# EAGLE design MainBoard (EAGLE 7.7.0)

## Sheet 1 of 2
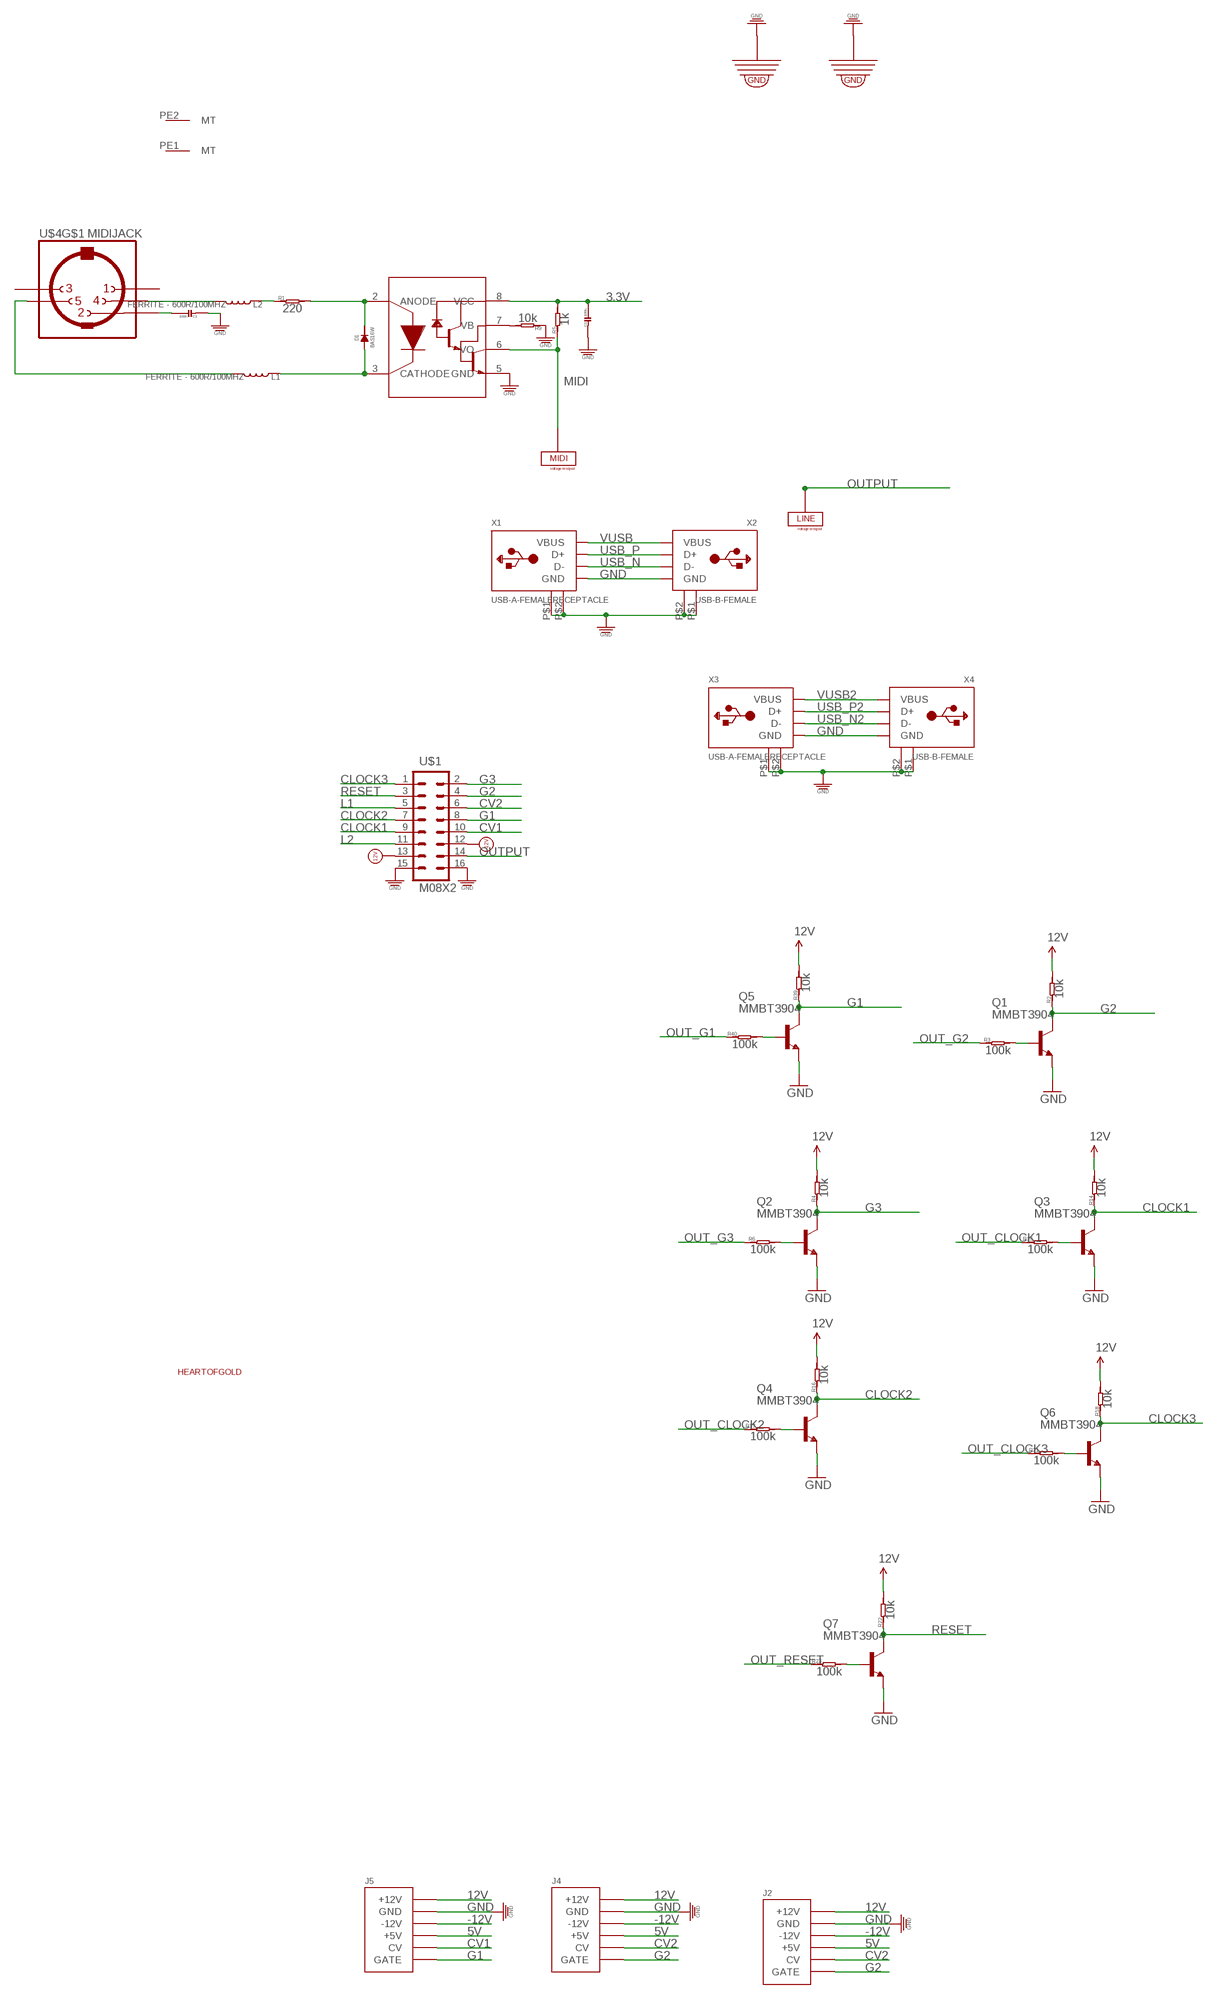
[diagram p0: schematic, sheet 1, part 1 of 3]
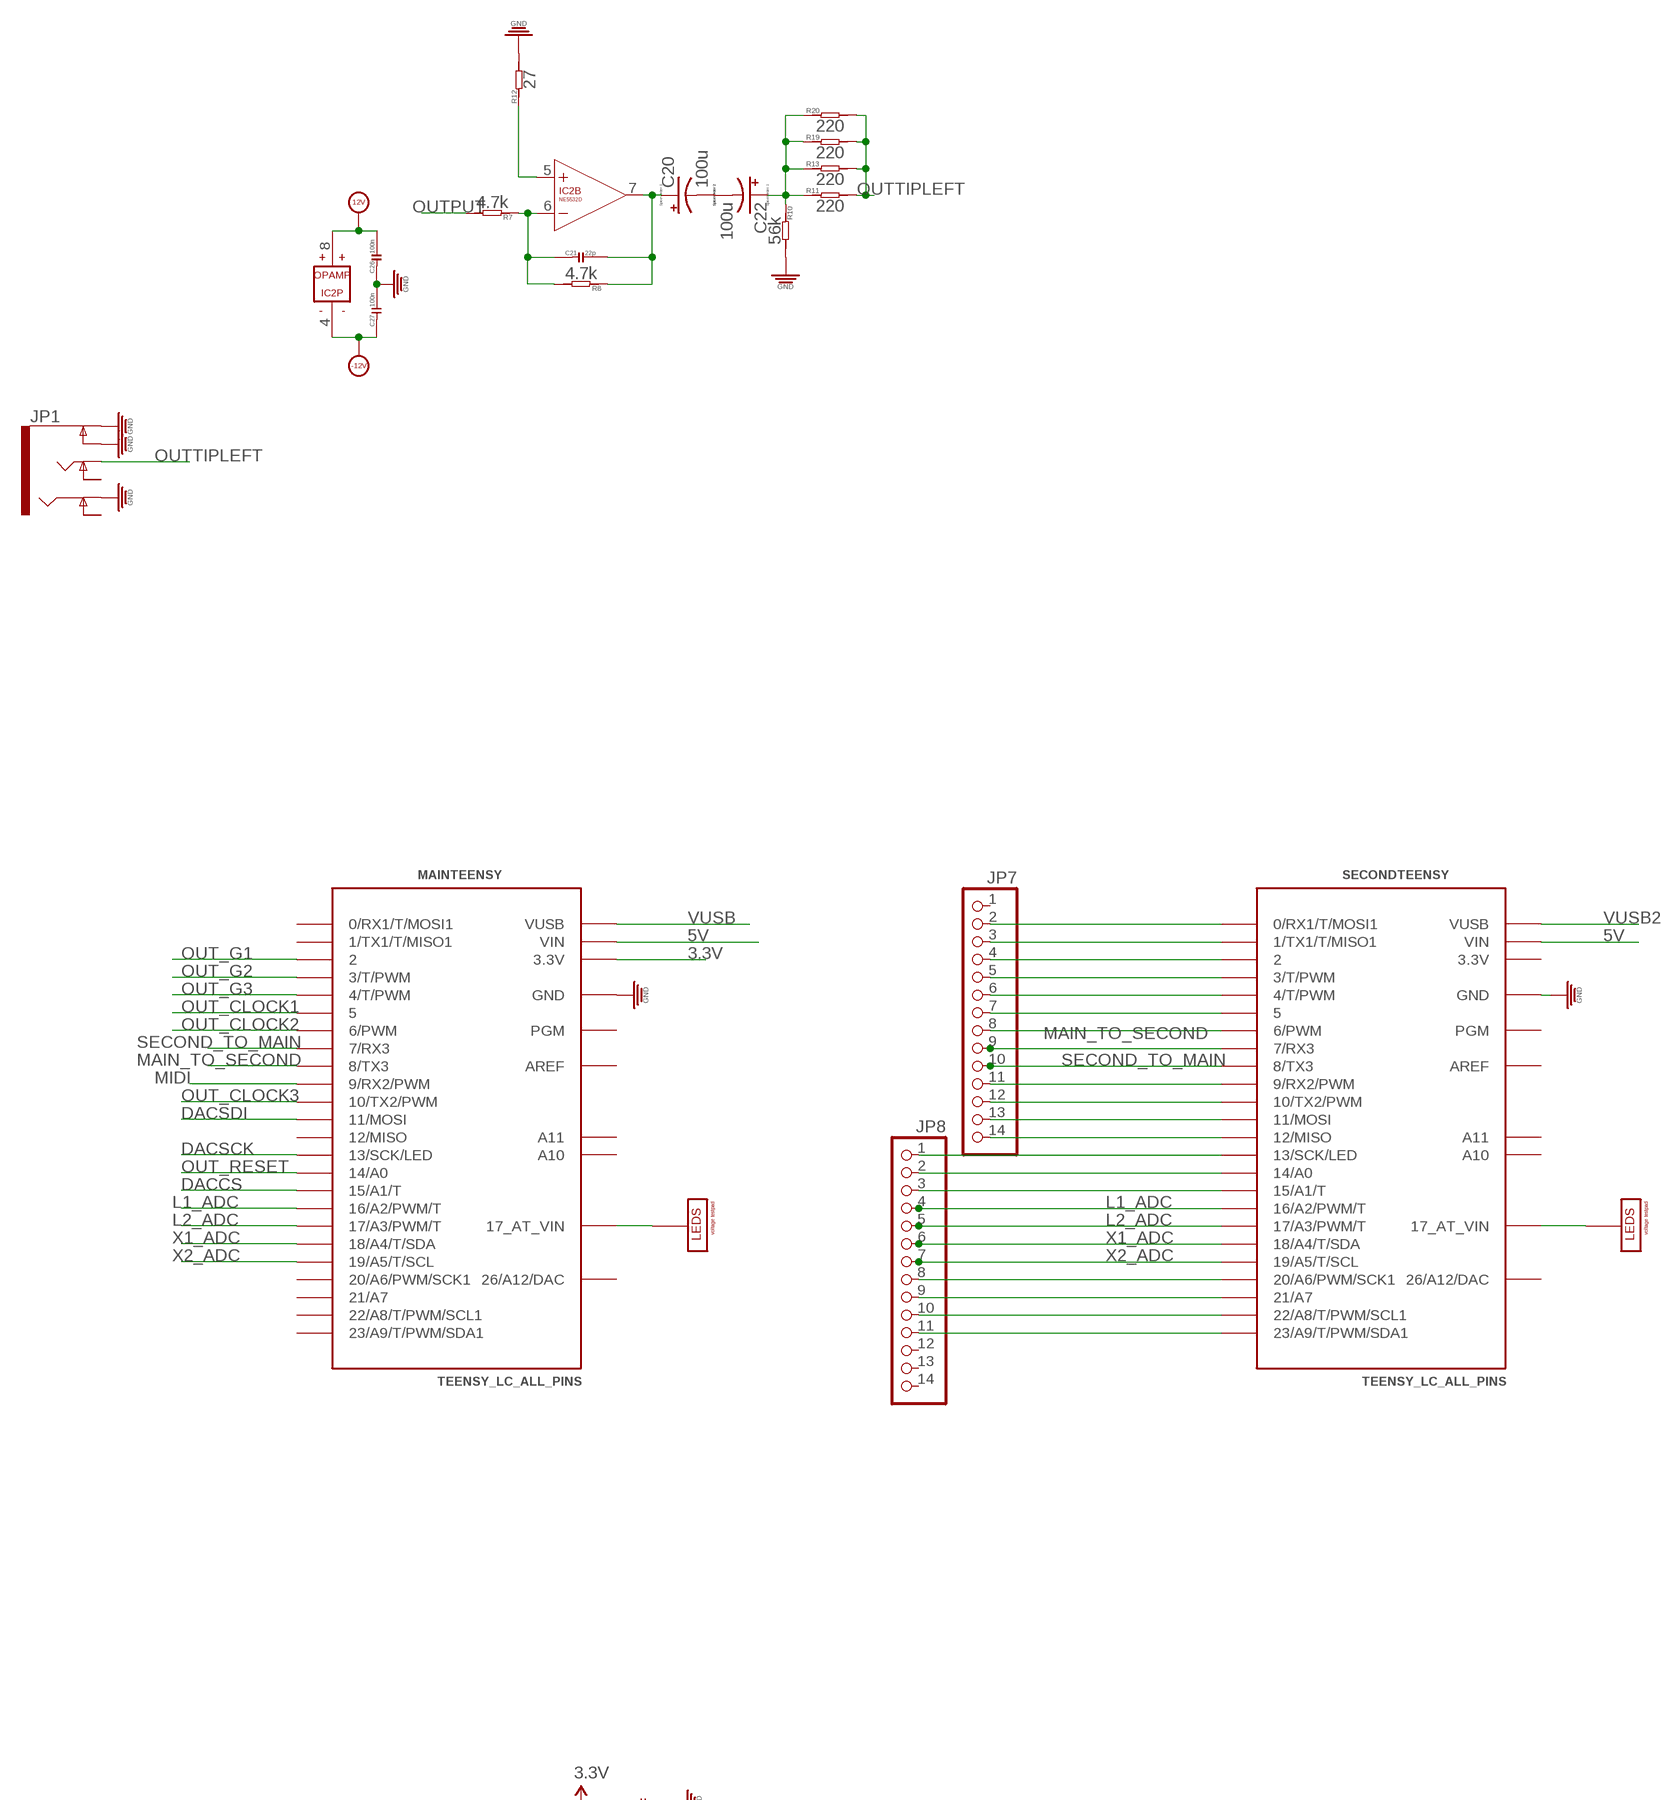
[diagram p1: schematic, sheet 1, part 2 of 3]
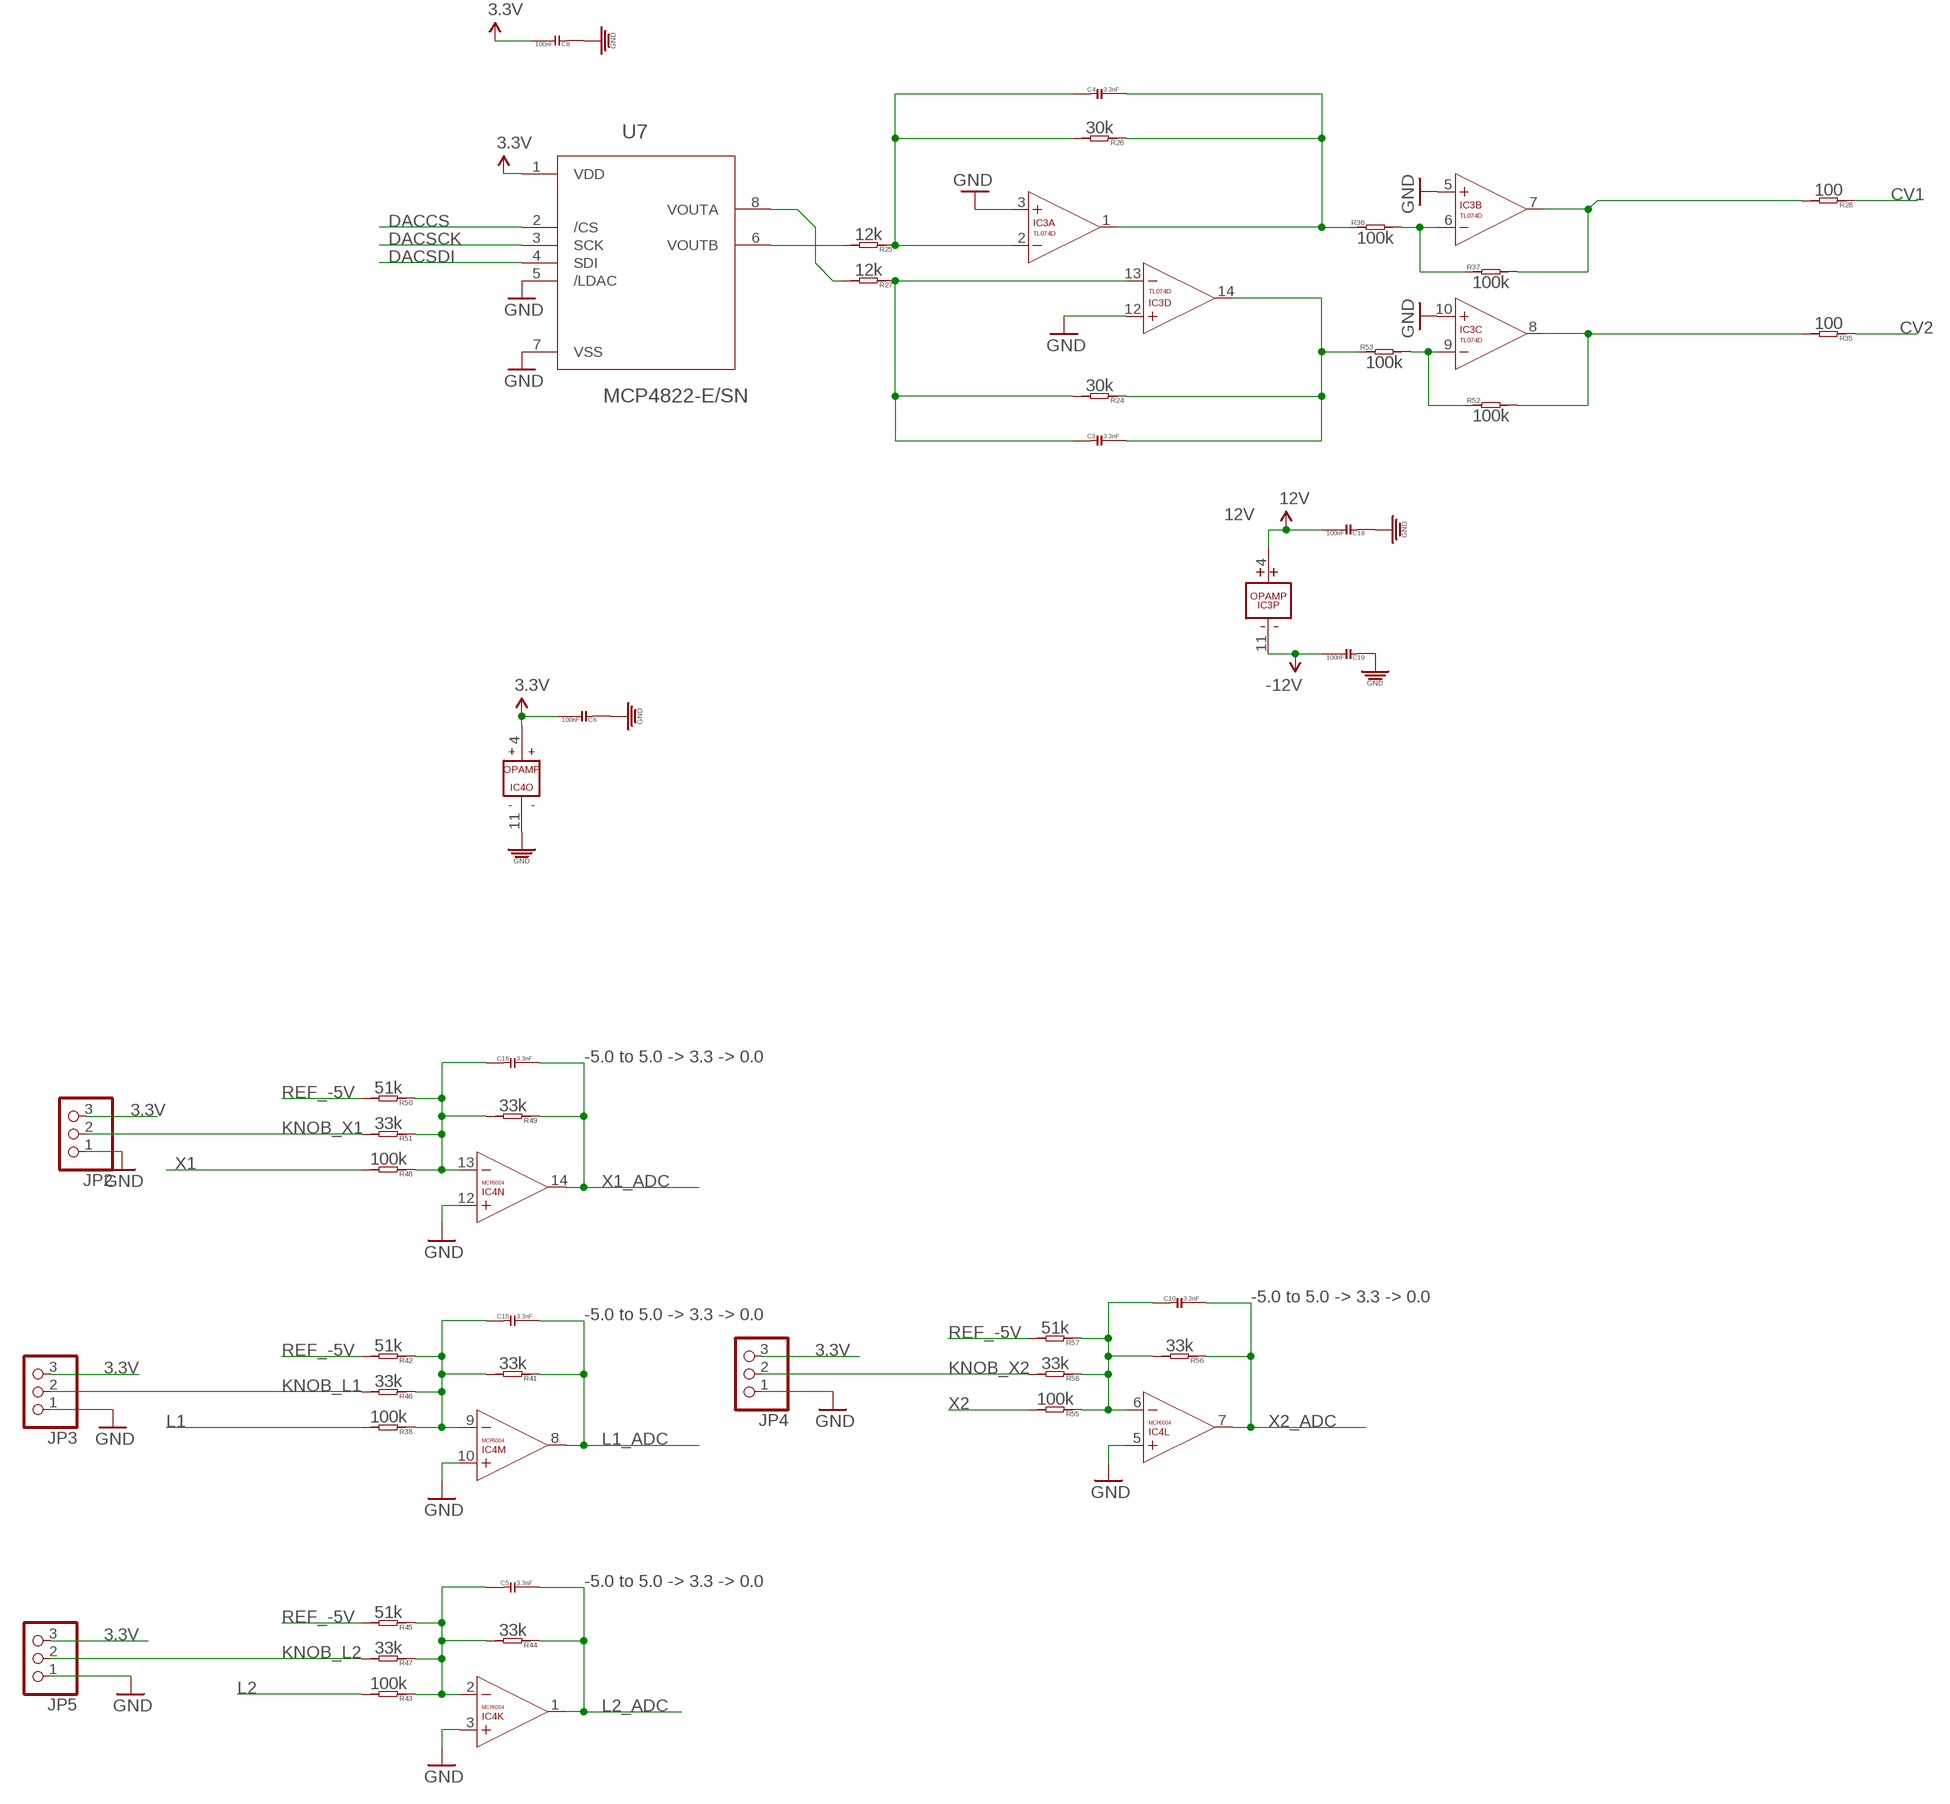
[diagram p2: schematic, sheet 1, part 3 of 3]

### Parts
C1  100n  C-0603  [C0603]
C2  100n  C-0603  [C0603]
C3  3.3nF  C-0603  [C0603]
C4  3.3nF  C-0603  [C0603]
C5  3.3nF  C-0603  [C0603]
C6  100nF  C-0603  [C0603]
C8  100nF  C-0603  [C0603]
C10  3.3nF  C-0603  [C0603]
C15  3.3nF  C-0603  [C0603]
C16  3.3nF  C-0603  [C0603]
C18  100nF  C-0603  [C0603]
C19  100nF  C-0603  [C0603]
C20  100u  CPOL-USD  [PANASONIC_D]
C21  22p  C-0603  [C0603]
C22  100u  CPOL-USD  [PANASONIC_D]
C26  100n  C-0603  [C0603]
C27  100n  C-0603  [C0603]
D1  BAS16W  [SOT-323]
IC2  NE5532D  [SO08]
IC3  TL074D  [SO14]
IC4  MCP6004  [SO14]
J2  POWER_SHROUDED_NOTEXT  [POWER_16_SHROUDED_NOTEXT]
J4  POWERSHROUDED  [POWER_16_SHROUDED]
J5  POWERSHROUDED  [POWER_16_SHROUDED]
JP1  AUDIO-JACK4-.25-HORIZ-TRS  [AUDIO-JACK-.25-INCH-HORIZ-PTH]
JP2  PINHD-1X3  [1X03]
JP3  PINHD-1X3  [1X03]
JP4  PINHD-1X3  [1X03]
JP5  PINHD-1X3  [1X03]
JP7  PINHD-1X14  [1X14]
JP8  PINHD-1X14  [1X14]
L1  FERRITE - 600R/100MHZ  L-0603  [L0603]
L2  FERRITE - 600R/100MHZ  L-0603  [L0603]
MAINTEENSY  TEENSY_LC_ALL_PINS  [TEENSY_3.0-3.2&LC_ALL_PINS]
Q1  MMBT3904  MMBT3904LT1-NPN-SOT23-BEC  [SOT23-BEC]
Q2  MMBT3904  MMBT3904LT1-NPN-SOT23-BEC  [SOT23-BEC]
Q3  MMBT3904  MMBT3904LT1-NPN-SOT23-BEC  [SOT23-BEC]
Q4  MMBT3904  MMBT3904LT1-NPN-SOT23-BEC  [SOT23-BEC]
Q5  MMBT3904  MMBT3904LT1-NPN-SOT23-BEC  [SOT23-BEC]
Q6  MMBT3904  MMBT3904LT1-NPN-SOT23-BEC  [SOT23-BEC]
Q7  MMBT3904  MMBT3904LT1-NPN-SOT23-BEC  [SOT23-BEC]
R1  220  R-0603  [R0603]
R2  10k  R-0603  [R0603]
R3  100k  R-0603  [R0603]
R4  10k  R-0603  [R0603]
R5  1k  R-0603  [R0603]
R6  100k  R-0603  [R0603]
R7  4.7k  R-0603  [R0603]
R8  4.7k  R-0603  [R0603]
R9  10k  R-0603  [R0603]
R10  56k  R-0603  [R0603]
R11  220  R-0603  [R0603]
R12  27  R-0603  [R0603]
R13  220  R-0603  [R0603]
R14  10k  R-0603  [R0603]
R15  100k  R-0603  [R0603]
R16  10k  R-0603  [R0603]
R17  100k  R-0603  [R0603]
R18  10k  R-0603  [R0603]
R19  220  R-0603  [R0603]
R20  220  R-0603  [R0603]
R21  100k  R-0603  [R0603]
R22  10k  R-0603  [R0603]
R23  100k  R-0603  [R0603]
R24  30k  R-0603  [R0603]
R25  12k  R-0603  [R0603]
R26  30k  R-0603  [R0603]
R27  12k  R-0603  [R0603]
R28  100  R-0603  [R0603]
R35  100  R-0603  [R0603]
R36  100k  R-0603  [R0603]
R37  100k  R-0603  [R0603]
R38  100k  R-0603  [R0603]
R39  10k  R-0603  [R0603]
R40  100k  R-0603  [R0603]
R41  33k  R-0603  [R0603]
R42  51k  R-0603  [R0603]
R43  100k  R-0603  [R0603]
R44  33k  R-0603  [R0603]
R45  51k  R-0603  [R0603]
R46  33k  R-0603  [R0603]
R47  33k  R-0603  [R0603]
R48  100k  R-0603  [R0603]
R49  33k  R-0603  [R0603]
R50  51k  R-0603  [R0603]
R51  33k  R-0603  [R0603]
R52  100k  R-0603  [R0603]
R53  100k  R-0603  [R0603]
R55  100k  R-0603  [R0603]
R56  33k  R-0603  [R0603]
R57  51k  R-0603  [R0603]
R58  33k  R-0603  [R0603]
SECONDTEENSY  TEENSY_LC_ALL_PINS  [TEENSY_3.0-3.2&LC_ALL_PINS]
U7  MCP4822-E/SN  [SOIC8-N_MC]
U$1  M08X2  [2X8]
U$3  VOLTAGETESTPAD  [POWERTESTPAD]
U$4  MIDIJACK  [CP-2350]
U$5  VOLTAGETESTPAD  [POWERTESTPAD]
U$17  HEARTOFGOLD  [HEARTOFGOLD]
U$19  GNDLOOP  [GROUNDLOOP]
U$20  6N139S  [8DIPSMD]
U$22  GNDLOOP  [GROUNDLOOP]
U$30  VOLTAGETESTPAD  [POWERTESTPAD]
U$32  VOLTAGETESTPAD  [POWERTESTPAD]
X1  USB-A-FEMALERECEPTACLE  [FCI87520]
X2  USB-B-FEMALE  [FCI61729]
X3  USB-A-FEMALERECEPTACLE  [FCI87520]
X4  USB-B-FEMALE  [FCI61729]

### Nets
3.3V [thin]: C2.2 C6.2 C8.2 IC4.4(O:V+) JP2.3 JP3.3 JP4.3 JP5.3 MAINTEENSY.3.3V MAINTEENSY.3.3V1(3.3V) R5.2 U7.1(VDD) U$20.8(VCC)
5V [power]: J2.11(+5V) J2.12(+5V) J4.11(+5V) J4.12(+5V) J5.11(+5V) J5.12(+5V) MAINTEENSY.VIN SECONDTEENSY.VIN ; also sheet 2
12V [power]: C18.2 C26.2 IC2.8(P:V+) IC3.4(P:V+) J2.9(+12V) J2.10(+12V) J4.9(+12V) J4.10(+12V) J5.9(+12V) J5.10(+12V) R2.2 R4.2 R14.2 R16.2 R18.2 R22.2 R39.2 U$1.13 ; also sheet 2
-12V [power]: C19.2 C27.1 IC2.4(P:V-) IC3.11(P:V-) J2.1(-12V) J2.2(-12V) J4.1(-12V) J4.2(-12V) J5.1(-12V) J5.2(-12V) U$1.12 ; also sheet 2
CLOCK1: Q3.C R14.1 U$1.9
CLOCK2: Q4.C R16.1 U$1.7
CLOCK3: Q6.C R18.1 U$1.1
CV1: J5.13(CV) J5.14(CV) R28.1 U$1.10
CV2: J2.13(CV) J2.14(CV) J4.13(CV) J4.14(CV) R35.1 U$1.6
DACCS: MAINTEENSY.15/A1(15/A1/T) U7.2(/CS)
DACSCK: MAINTEENSY.13(13/SCK/LED) U7.3(SCK)
DACSDI: MAINTEENSY.11(11/MOSI) U7.4(SDI)
G1: J5.15(GATE) J5.16(GATE) Q5.C R39.1 U$1.8
G2: J2.15(GATE) J2.16(GATE) J4.15(GATE) J4.16(GATE) Q1.C R2.1 U$1.4
G3: Q2.C R4.1 U$1.2
GND: C1.1 C2.1 C6.1 C8.1 C18.1 C19.1 C26.1 C27.2 IC3.3(A:+IN) IC3.5(B:+IN) IC3.10(C:+IN) IC3.12(D:+IN) IC4.3(K:+IN) IC4.5(L:+IN) IC4.10(M:+IN) IC4.11(O:V-) IC4.12(N:+IN) J2.3(GND) J2.4(GND) J2.5(GND) J2.6(GND) J2.7(GND) J2.8(GND) J4.3(GND) J4.4(GND) J4.5(GND) J4.6(GND) J4.7(GND) J4.8(GND) J5.3(GND) J5.4(GND) J5.5(GND) J5.6(GND) J5.7(GND) J5.8(GND) JP1.P$2(EARTH) JP1.P$3(EARTH-NORM) JP1.P$4(RING) JP2.1 JP3.1 JP4.1 JP5.1 MAINTEENSY.AGND(GND) MAINTEENSY.GND MAINTEENSY.GND1(GND) Q1.E Q2.E Q3.E Q4.E Q5.E Q6.E Q7.E R9.1 R10.2 R12.2 SECONDTEENSY.AGND(GND) SECONDTEENSY.GND SECONDTEENSY.GND1(GND) U7.5(/LDAC) U7.7(VSS) U$1.15 U$1.16 U$19.P$1 U$19.P$2 U$20.5(GND) U$22.P$1 U$22.P$2 X1.P4(GND) X1.P$1(GND1) X1.P$2(GND2) X2.4(GND) X2.P$1(GND1) X2.P$2(GND2) X3.P4(GND) X3.P$1(GND1) X3.P$2(GND2) X4.4(GND) X4.P$1(GND1) X4.P$2(GND2) ; also sheet 2
KNOB_L1: JP3.2 R46.2
KNOB_L2: JP5.2 R47.2
KNOB_X1: JP2.2 R51.2
KNOB_X2: JP4.2 R58.2
L1: R38.2 U$1.5
L1_ADC: C15.2 IC4.8(M:OUT) JP8.4 MAINTEENSY.16/A2(16/A2/PWM/T) R41.1 SECONDTEENSY.16/A2(16/A2/PWM/T)
L2: R43.2 U$1.11
L2_ADC: C5.2 IC4.1(K:OUT) JP8.5 MAINTEENSY.17/A3(17/A3/PWM/T) R44.1 SECONDTEENSY.17/A3(17/A3/PWM/T)
MAIN_TO_SECOND: JP7.9 MAINTEENSY.8(8/TX3) SECONDTEENSY.7(7/RX3)
MIDI [thin]: MAINTEENSY.9(9/RX2/PWM) R5.1 U$20.6(VO) U$30.P$1(VOLTAGE) U$30.P$2(VOLTAGE) U$30.P$3(VOLTAGE)
N$2: R9.2 U$20.7(VB)
N$3: C20.- C22.-
N$6: L1.2 U$4.5
N$7: L2.2 U$4.4
N$10: MAINTEENSY.VBAT(17_AT_VIN) U$3.P$1(VOLTAGE) U$3.P$2(VOLTAGE) U$3.P$3(VOLTAGE)
N$12: SECONDTEENSY.VBAT(17_AT_VIN) U$5.P$1(VOLTAGE) U$5.P$2(VOLTAGE) U$5.P$3(VOLTAGE)
N$13: C21.1 IC2.6(B:-IN) R7.1 R8.2
N$14: C20.+ C21.2 IC2.7(B:OUT) R8.1
N$15: C22.+ R10.1 R11.1 R13.1 R19.1 R20.1
N$16: IC2.5(B:+IN) R12.1
N$17: Q1.B R3.2
N$18: Q2.B R6.2
N$19: Q3.B R15.2
N$20: Q4.B R17.2
N$21: Q6.B R21.2
N$22: Q7.B R23.2
N$23: C4.2 IC3.1(A:OUT) R26.1 R36.1
N$24: C3.2 IC3.14(D:OUT) R24.1 R53.1
N$25: C3.1 IC3.13(D:-IN) R24.2 R27.1
N$26: C4.1 IC3.2(A:-IN) R25.1 R26.2
N$27: C10.1 IC4.6(L:-IN) R55.1 R56.2 R57.1 R58.1
N$30: JP7.2 SECONDTEENSY.0(0/RX1/T/MOSI1)
N$31: IC3.6(B:-IN) R36.2 R37.1
N$35: IC3.7(B:OUT) R28.2 R37.2
N$36: IC3.9(C:-IN) R52.1 R53.2
N$37: R27.2 U7.8(VOUTA)
N$38: R25.2 U7.6(VOUTB)
N$39: JP7.3 SECONDTEENSY.1(1/TX1/T/MISO1)
N$40: C1.2 U$4.2
N$41: L2.1 R1.1
N$42: D1.ANODE L1.1 U$20.3(CATHODE)
N$43: D1.CATHODE R1.2 U$20.2(ANODE)
N$44: C15.1 IC4.9(M:-IN) R38.1 R41.2 R42.1 R46.1
N$45: JP7.4 SECONDTEENSY.2
N$46: C5.1 IC4.2(K:-IN) R43.1 R44.2 R45.1 R47.1
N$47: JP7.5 SECONDTEENSY.3(3/T/PWM)
N$48: C16.1 IC4.13(N:-IN) R48.1 R49.2 R50.1 R51.1
N$49: JP7.6 SECONDTEENSY.4(4/T/PWM)
N$50: JP7.7 SECONDTEENSY.5
N$51: JP7.8 SECONDTEENSY.6(6/PWM)
N$52: JP7.11 SECONDTEENSY.9(9/RX2/PWM)
N$53: JP7.12 SECONDTEENSY.10(10/TX2/PWM)
N$54: JP7.13 SECONDTEENSY.11(11/MOSI)
N$55: JP7.14 SECONDTEENSY.12(12/MISO)
N$56: JP8.1 SECONDTEENSY.13(13/SCK/LED)
N$57: JP8.2 SECONDTEENSY.14/A0
N$58: JP8.3 SECONDTEENSY.15/A1(15/A1/T)
N$59: JP8.8 SECONDTEENSY.20/A6(20/A6/PWM/SCK1)
N$60: Q5.B R40.2
N$61: JP8.9 SECONDTEENSY.21/A7
N$62: JP8.10 SECONDTEENSY.22/A8(22/A8/T/PWM/SCL1)
N$63: JP8.11 SECONDTEENSY.23/A9(23/A9/T/PWM/SDA1)
N$94: IC3.8(C:OUT) R35.2 R52.2
OUT_CLOCK1: MAINTEENSY.5 R15.1
OUT_CLOCK2: MAINTEENSY.6(6/PWM) R17.1
OUT_CLOCK3: MAINTEENSY.10(10/TX2/PWM) R21.1
OUT_G1: MAINTEENSY.2 R40.1
OUT_G2: MAINTEENSY.3(3/T/PWM) R3.1
OUT_G3: MAINTEENSY.4(4/T/PWM) R6.1
OUT_RESET: MAINTEENSY.14/A0 R23.1
OUTPUT: R7.2 U$1.14 U$32.P$1(VOLTAGE) U$32.P$2(VOLTAGE) U$32.P$3(VOLTAGE)
OUTTIPLEFT: JP1.P$6(TIP) R11.2 R13.2 R19.2 R20.2
REF_-5V: R42.2 R45.2 R50.2 R57.2 ; also sheet 2
RESET: Q7.C R22.1 U$1.3
SECOND_TO_MAIN: JP7.10 MAINTEENSY.7(7/RX3) SECONDTEENSY.8(8/TX3)
USB_N [USB]: X1.P2(D-) X2.2(D-)
USB_N2 [USB]: X3.P2(D-) X4.2(D-)
USB_P [USB]: X1.P3(D+) X2.3(D+)
USB_P2 [USB]: X3.P3(D+) X4.3(D+)
VUSB: MAINTEENSY.VUSB X1.P1(VBUS) X2.1(VBUS)
VUSB2 [power]: SECONDTEENSY.VUSB X3.P1(VBUS) X4.1(VBUS)
X1: R48.2
X1_ADC: C16.2 IC4.14(N:OUT) JP8.6 MAINTEENSY.18/A4(18/A4/T/SDA) R49.1 SECONDTEENSY.18/A4(18/A4/T/SDA)
X2: R55.2
X2_ADC: C10.2 IC4.7(L:OUT) JP8.7 MAINTEENSY.19/A5(19/A5/T/SCL) R56.1 SECONDTEENSY.19/A5(19/A5/T/SCL)
Unconnected: IC2.1(A:OUT) IC2.2(A:-IN) IC2.3(A:+IN) JP1.P$5(RING-NORM) JP1.P$7(TIP-NORM) JP7.1 JP8.12 JP8.13 JP8.14 MAINTEENSY.0(0/RX1/T/MOSI1) MAINTEENSY.1(1/TX1/T/MISO1) MAINTEENSY.12(12/MISO) MAINTEENSY.20/A6(20/A6/PWM/SCK1) MAINTEENSY.21/A7 MAINTEENSY.22/A8(22/A8/T/PWM/SCL1) MAINTEENSY.23/A9(23/A9/T/PWM/SDA1) MAINTEENSY.A10 MAINTEENSY.A11 MAINTEENSY.AREF MAINTEENSY.PGM MAINTEENSY.RESET/DAC(26/A12/DAC) SECONDTEENSY.3.3V SECONDTEENSY.3.3V1(3.3V) SECONDTEENSY.A10 SECONDTEENSY.A11 SECONDTEENSY.AREF SECONDTEENSY.PGM SECONDTEENSY.RESET/DAC(26/A12/DAC) U$4.1 U$4.3 U$4.PE1(MT) U$4.PE2(MT) U$4.PE(MT) U$4.PE@(MT)

### Notes on the sheet
- -5.0 to 5.0 -> 3.3 -> 0.0
- -5.0 to 5.0 -> 3.3 -> 0.0
- -5.0 to 5.0 -> 3.3 -> 0.0
- -5.0 to 5.0 -> 3.3 -> 0.0

## Sheet 2 of 2: Voltages
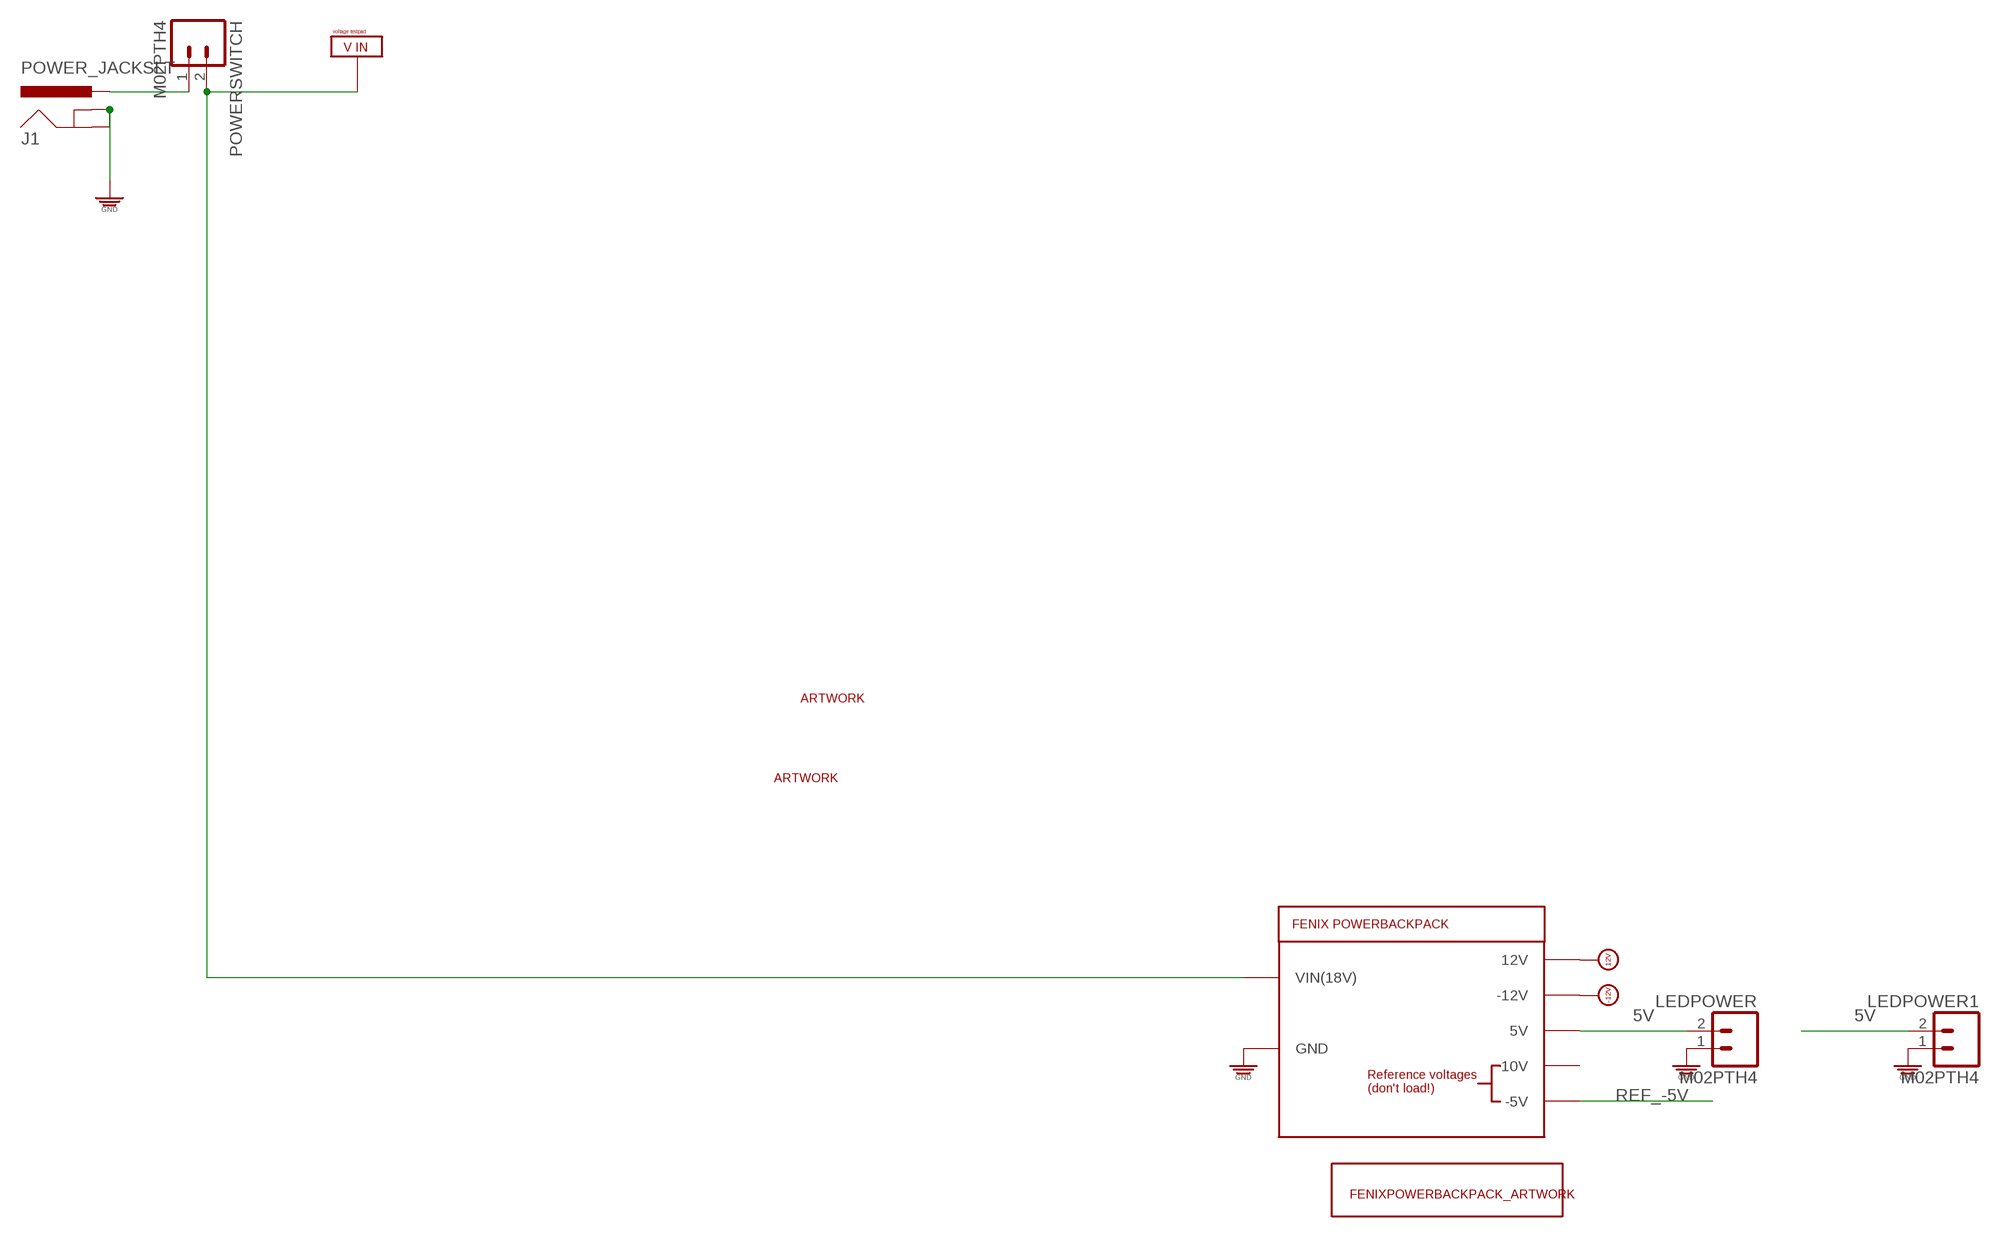
[diagram p3: schematic, sheet 2]

### Parts
J1  POWER_JACKSLT  [POWER_JACK_SLOT]
LEDPOWER  M02PTH4  [1X02_XTRA_BIG]
LEDPOWER1  M02PTH4  [1X02_XTRA_BIG]
POWERSWITCH  M02PTH4  [1X02_XTRA_BIG]
U$23  FENIXPOWERBACKPACK_MODULE  [FENIXPOWERBACKPACK]
U$25  FENIXPOWERBACKPACKART_MODULE  [FENIXPOWERBACKPACK_MODULE]
U$29  VOLTAGETESTPAD  [POWERTESTPAD]
U$34  TINRS_ARTWORKTINYDATE  [JUSTATINYROCKET_DATECODE]
U$35  TINRS_ARTWORKTINYDATE  [JUSTATINYROCKET_DATECODE]

### Nets
5V [power]: LEDPOWER1.2 LEDPOWER.2 U$23.5V@1(5V) U$23.5V@2(5V) U$23.5V@3(5V) U$23.5V@4(5V) ; also sheet 1
9TO18V [power]: POWERSWITCH.2 U$23.VIN@1(VIN(18V)) U$23.VIN@2(VIN(18V)) U$23.VIN@3(VIN(18V)) U$23.VIN@4(VIN(18V)) U$29.P$1(VOLTAGE) U$29.P$2(VOLTAGE) U$29.P$3(VOLTAGE)
12V [power]: U$23.12V@1(12V) U$23.12V@2(12V) U$23.12V@4(12V) ; also sheet 1
-12V [power]: U$23.-12V@1(-12V) U$23.-12V@2(-12V) U$23.-12V@3(-12V) ; also sheet 1
GND: J1.GND@1(GNDBREAK) J1.GND@2(GND) LEDPOWER1.1 LEDPOWER.1 U$23.GND@1(GND) U$23.GND@2(GND) U$23.GND@3(GND) U$23.GND@4(GND) U$23.GND@5(GND) U$23.GND@6(GND) U$23.GND@7(GND) U$23.GND@8(GND) U$23.GND@9(GND) U$23.GND@10(GND) U$23.GND@11(GND) U$23.GND@12(GND) U$23.GND@13(GND) U$23.GND@14(GND) ; also sheet 1
REF_-5V: U$23.-5V U$23.-5V@2(-5V) ; also sheet 1
VIN [power]: J1.PWR POWERSWITCH.1
Unconnected: U$23.10V U$23.10V@2(10V)

## Library data of the parts
C1 C2 C21 C26 C27 = OPL:C*
C3-C5 C10 C15 C16 = OPL:C*; OC_FARNELL: unknown
C6 C8 C18 C19 = OPL:C*; MF: MULTICOMP; MPN: MC0603F104Z160CT; OC_FARNELL: 1759017
C20 C22 = resistor:CPOL-US: POLARIZED CAPACITOR, American symbol
D1 = FenixBase:BAS16W
IC2 = EurorackModularParts:NE5532: AUDIO AMPLIFIER
IC3 = EurorackModularParts:TL074: OP AMP; MF: TEXAS INSTRUMENTS; MPN: TL074CD; OC_FARNELL: 1103010
IC4 = EurorackModularParts:MCP6004; MF: MICROCHIP; MPN: MCP6004-I/SL.; OC_FARNELL: 1605572
J1 = SparkFun-Connectors:POWER_JACK: Power Jack This is the standard 5.5mm barrel jack for power. The PTH is the most common, proven, reliable, footprint. The Slot footprint only works if the mill layer is transmitted to the PCB fab house so be warned. Spark Fun Electronics SKU : PRT-00119 SMT: CONN-08106 Mating wall wart : TOL-00298 (and others)
J2 J4 J5 = EurorackModularParts:POWER
JP1 = EurorackModularParts:AUDIO-JACK4-.25-HORIZ-TRS: 1/4" TRS jack, horizontal Production SKU: COM-11144 Footprint unproven - datasheet and part seem to be slightly different; PROD_ID: COM-11144
JP2-JP5 = pinhead:PINHD-1X3: PIN HEADER
JP7 JP8 = pinhead:PINHD-1X14: PIN HEADER
L1 L2 = OPL:L*
LEDPOWER LEDPOWER1 POWERSWITCH = SparkFun-Connectors:M02: Standard 2-pin 0.1" header. Use with - straight break away headers ( PRT-00116) - right angle break away headers (PRT-00553) - swiss pins (PRT-00743) - machine pins (PRT-00117) - female headers (PRT-00115) Molex polarized connector foot print use with: PRT-08233 with associated crimp pins and housings. 2.54_SCREWTERM for use with PRT-10571. 3.5mm Screw Terminal footprints for PRT-08084 5mm Screw Terminal footprints for use with PRT-08433
MAINTEENSY SECONDTEENSY = Teensy_3_and_LC_Series_Boards_v1.4:TEENSY_LC_ALL_PINS: Teensy LC board with all pins used.
Q1-Q7 = transistor:*-NPN-: NPN Transistror BF959 corrected 2008.03.06; MF: NXP; MPN: PMBT3904,215; OC_FARNELL: 2336795
R1 R5 R7-R13 R19 R20 = OPL:R*
R2-R4 R6 R14-R18 R21-R28 R35-R53 R55-R58 = OPL:R*; OC_FARNELL: unknown
U7 = FarnellThings:MCP4822-E/SN: 12 Bit DAC; DESCRIPTION: 12 Bit DAC; MF: MICROCHIP; MPN: MCP4822-E/SN; OC_FARNELL: 1439414; OC_NEWARK: 31K2975; PACKAGE: SOIC-8; SUPPLIER: Microchip
U$1 = SparkFun-Connectors:M08X2: .1" headers, two rows of 8 each
U$3 U$5 = FenixBase:VOLTAGETESTPAD; DESC: LEDS
U$4 = adafruit:MIDIJACK: DIN 5 jack also known as MIDI jack A modification of conn-hirshman:MAB5SH with two options for the grounding 'teeth'
U$17 = FenixBase:HEARTOFGOLD
U$19 U$22 = FenixBase:GNDLOOP
U$20 = FenixBase:6N139S
U$23 = EurorackModularParts:FENIXPOWERBACKPACK
U$25 = EurorackModularParts:FENIXPOWERBACKPACKART
U$29 = FenixBase:VOLTAGETESTPAD; DESC: V IN
U$30 = FenixBase:VOLTAGETESTPAD; DESC: MIDI
U$32 = FenixBase:VOLTAGETESTPAD; DESC: LINE
U$34 U$35 = EurorackModularParts:TINRS_ARTWORK
X1 X3 = ld-components:USB-A-FEMALE: USB type A receptacle FCI 87520-0010BLF
X2 X4 = ld-components:USB-B-FEMALE: USB type B receptacle FCI 61729-59796

## Net classes
0 default: width 0.254 mm
1 power: width 1 mm
2 thin: width 0.254 mm
3 USB: width 0.254 mm, clearance 0.254 mm

## Board
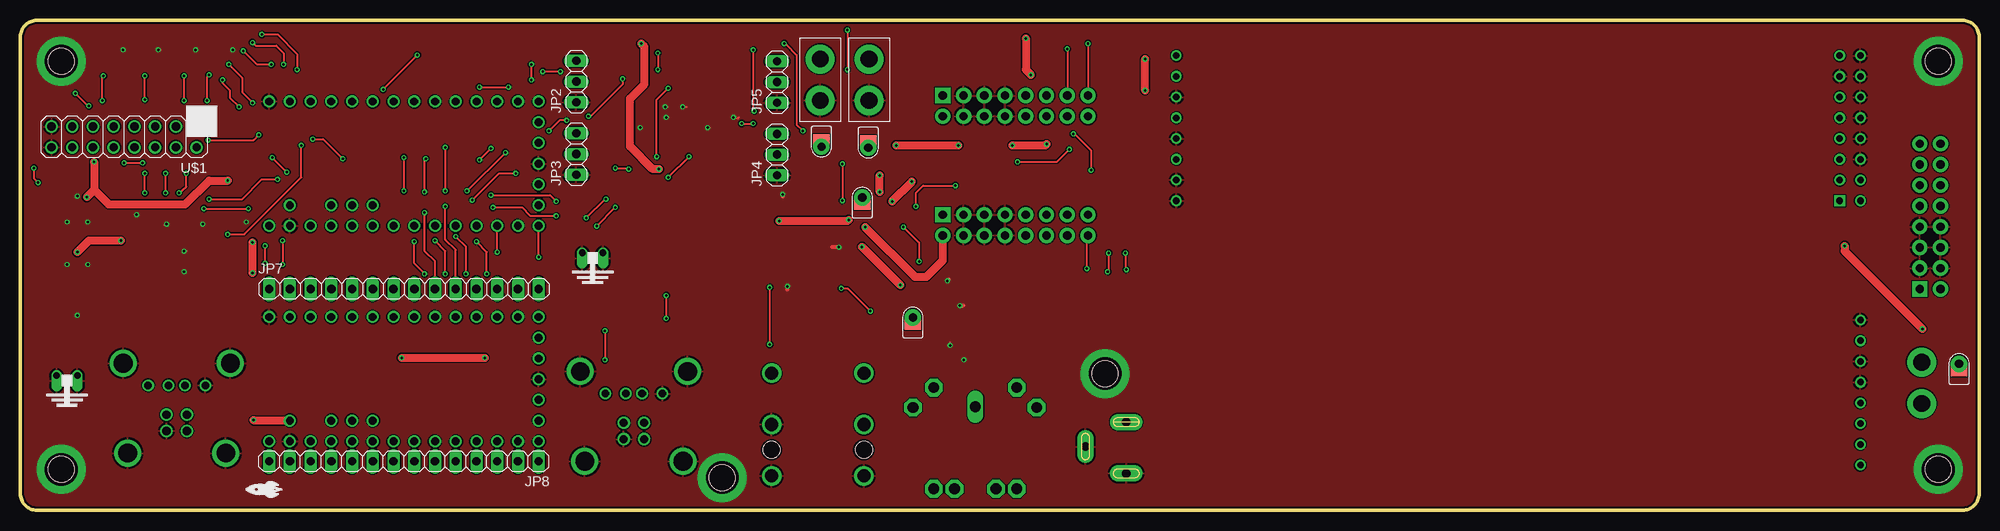
[diagram p4: board, top side]
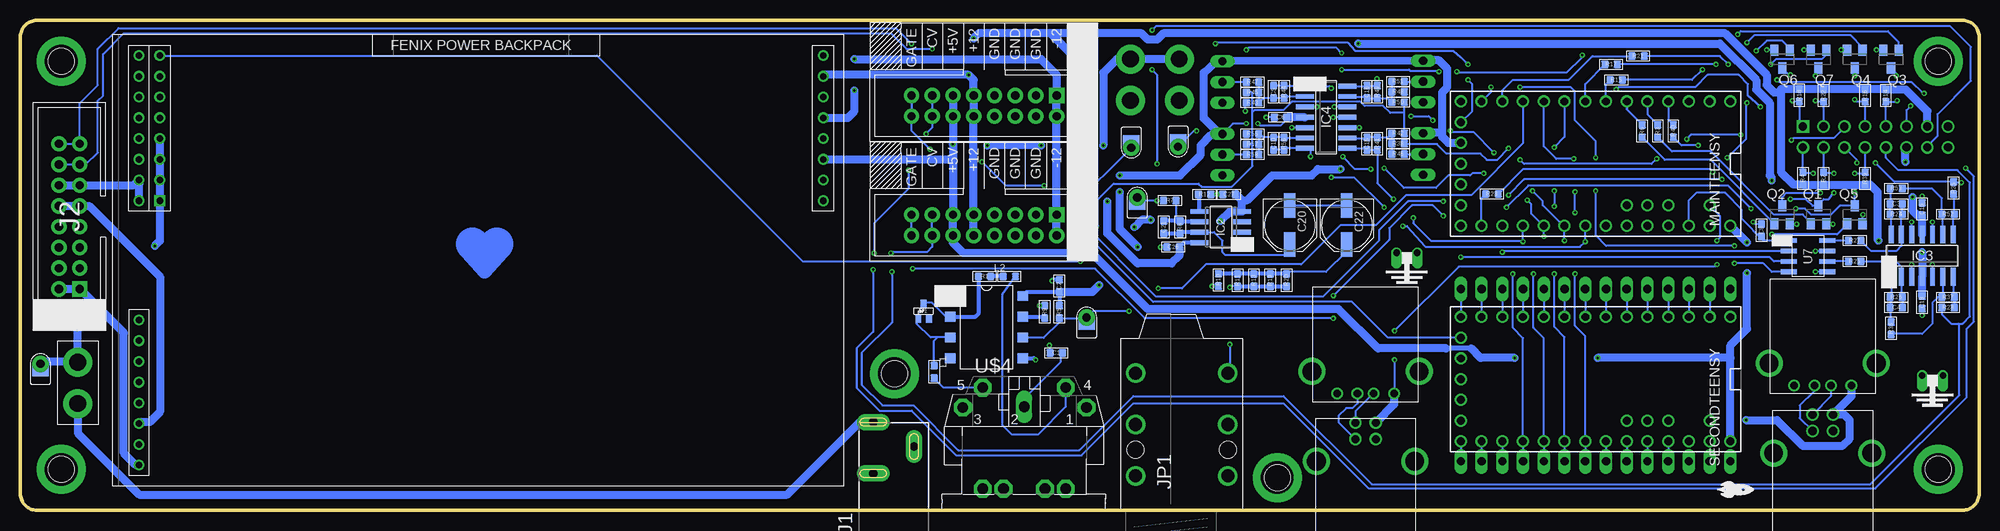
[diagram p5: board, bottom side, seen from below]

Size 240 x 60 mm. Coordinates in mm from the lower left corner, seen from the top.
Outline: 240,58 240,2 arc-90 238,0 2,0 arc-90 0,2 0,58 arc-90 2,60 238,60 arc-90 240,58
Copper layers (1*16): Top 0.035mm / dielectric 1.5mm / Bottom 0.035mm
Design rules "ITEADstudio_DRC": minimum track width 6mil, minimum drill 12mil, track to track 6mil, track to pad 6mil, pad to pad 6mil, via to via 6mil, smd to smd 0mil, copper to edge 10mil, drill to drill 10mil, minimum pad ring 10mil, minimum via ring 6mil, stop-mask expansion 2mil, vias tented up to drill 100mil, thermal gap 10mil
Holes 3.2 mm at 235,5 5,55 5,5 132.91,16.73 235,55 86,4

### Footprints (pad centres in the part's own frame; a part is rotated, then mirrored left to right if it is on the bottom)
C0603 = smd 0.889 x 0.889: 1 -0.762,0; 2 0.762,0
PANASONIC_D = smd 3 x 1.4: + 2.4,0; - -2.4,0
SOT-323 = smd 0.7 x 0.9: ANODE -0.65,-0.95; CATHODE 0,0.95; NC 0.65,-0.95
SO08 = smd 0.6 x 2.2: 1 -1.905,-2.6; 2 -0.635,-2.6; 3 0.635,-2.6; 4 1.905,-2.6; 5 1.905,2.6; 6 0.635,2.6; 7 -0.635,2.6; 8 -1.905,2.6
SO14 = smd 0.6 x 2.2: 1 -3.81,-2.6; 2 -2.54,-2.6; 3 -1.27,-2.6; 4 0,-2.6; 5 1.27,-2.6; 6 2.54,-2.6; 7 3.81,-2.6; 8 3.81,2.6; 9 2.54,2.6; 10 1.27,2.6; 11 0,2.6; 12 -1.27,2.6; 13 -2.54,2.6; 14 -3.81,2.6
POWER_JACK_SLOT = drill 1 pad 2 long: GND@1 2.58,7.5; GND@2 7.58,10.8; PWR 2.58,13.8
POWER_16_SHROUDED_NOTEXT = drill 1.016 pad 1.88 square: 1 -8.89,-1.27 | drill 1.016 pad 1.88: 2 -8.89,1.27; 3 -6.35,-1.27; 4 -6.35,1.27; 5 -3.81,-1.27; 6 -3.81,1.27; 7 -1.27,-1.27; 8 -1.27,1.27; 9 1.27,-1.27; 10 1.27,1.27; 11 3.81,-1.27; 12 3.81,1.27; 13 6.35,-1.27; 14 6.35,1.27; 15 8.89,-1.27; 16 8.89,1.27
POWER_16_SHROUDED = drill 1.016 pad 1.88 square: 1 -8.89,-1.27 | drill 1.016 pad 1.88: 2 -8.89,1.27; 3 -6.35,-1.27; 4 -6.35,1.27; 5 -3.81,-1.27; 6 -3.81,1.27; 7 -1.27,-1.27; 8 -1.27,1.27; 9 1.27,-1.27; 10 1.27,1.27; 11 3.81,-1.27; 12 3.81,1.27; 13 6.35,-1.27; 14 6.35,1.27; 15 8.89,-1.27; 16 8.89,1.27
AUDIO-JACK-.25-INCH-HORIZ-PTH = drill 1.6: P$2 4.2,-6.95; P$3 4.2,4.35; P$4 10.5,-6.95; P$5 10.5,4.35; P$6 16.8,-6.95; P$7 16.8,4.35 | hole 2.1: 7.4,4.35; 7.4,-6.95
1X03 = drill 1.016 long: 1 -2.54,0; 2 0,0; 3 2.54,0
1X14 = drill 1.016 long: 1 -16.51,0; 2 -13.97,0; 3 -11.43,0; 4 -8.89,0; 5 -6.35,0; 6 -3.81,0; 7 -1.27,0; 8 1.27,0; 9 3.81,0; 10 6.35,0; 11 8.89,0; 12 11.43,0; 13 13.97,0; 14 16.51,0
L0603 = smd 0.889 x 0.889: 1 -0.762,0; 2 0.762,0
1X02_XTRA_BIG = drill 2.057 pad 3.556: 1 -2.54,0; 2 2.54,0
TEENSY_3.0-3.2&LC_ALL_PINS = drill 0.965: 0 -7.62,13.97; 1 -7.62,11.43; 2 -7.62,8.89; 3 -7.62,6.35; 3.3V 7.62,11.43; 3.3V1 -2.54,-16.51; 4 -7.62,3.81; 5 -7.62,1.27; 6 -7.62,-1.27; 7 -7.62,-3.81; 8 -7.62,-6.35; 9 -7.62,-8.89; 10 -7.62,-11.43; 11 -7.62,-13.97; 12 -7.62,-16.51; 13 7.62,-16.51; 14/A0 7.62,-13.97; 15/A1 7.62,-11.43; 16/A2 7.62,-8.89; 17/A3 7.62,-6.35; 18/A4 7.62,-3.81; 19/A5 7.62,-1.27; 20/A6 7.62,1.27; 21/A7 7.62,3.81; 22/A8 7.62,6.35; 23/A9 7.62,8.89; A10 5.08,6.35; A11 5.08,3.81; AGND 7.62,13.97; AREF 5.08,8.89; GND -7.62,16.51; GND1 0,-16.51; PGM 2.54,-16.51; RESET/DAC 5.08,-16.51; VBAT -5.08,-16.51; VIN 7.62,16.51; VUSB 5.08,13.97
SOT23-BEC = smd 1 x 1.4: B -0.95,-1.1; C 0,1.1; E 0.95,-1.1
R0603 = smd 0.889 x 0.889: 1 -0.762,0; 2 0.762,0
SOIC8-N_MC = smd 1.981 x 0.559: 1 -2.362,1.905; 2 -2.362,0.635; 3 -2.362,-0.635; 4 -2.362,-1.905; 5 2.362,-1.905; 6 2.362,-0.635; 7 2.362,0.635; 8 2.362,1.905
2X8 = drill 1.016 square: 1 0,0 | drill 1.016: 2 0,2.54; 3 2.54,0; 4 2.54,2.54; 5 5.08,0; 6 5.08,2.54; 7 7.62,0; 8 7.62,2.54; 9 10.16,0; 10 10.16,2.54; 11 12.7,0; 12 12.7,2.54; 13 15.24,0; 14 15.24,2.54; 15 17.78,0; 16 17.78,2.54
POWERTESTPAD = drill 1 pad 2: P$1 0,0 | smd 2 x 1.5: P$2 0,-0.75 | smd 2 x 1.5 bottom: P$3 0,-0.75
CP-2350 = drill 1.321 pad 2.184 octagon: 1 7.62,12.58; 3 -7.52,12.58; 4 5.08,15.02; 5 -5.08,15.02; PE -2.54,2.62; PE1 -5.08,2.62; PE2 5.08,2.62; PE@ 2.54,2.62 | drill 1.321 long: 2 0,12.68
GROUNDLOOP = drill 0.8 offset: P$1 1.27,0; P$2 -1.27,0
8DIPSMD = smd 1.194 x 1.27: 1 -3.81,-4.445; 2 -1.27,-4.445; 3 1.27,-4.445; 4 3.81,-4.445; 5 3.81,4.445; 6 1.27,4.445; 7 -1.27,4.445; 8 -3.81,4.445
FENIXPOWERBACKPACK = drill 0.8: 5V@1 2.54,44.45; 5V@2 86.36,46.99; 5V@3 2.54,24.765; 5V@4 2.54,41.91; 10V 86.36,59.69; 10V@2 2.54,17.145; 12V@1 86.36,57.15; 12V@2 5.08,52.07; 12V@4 2.54,14.605; -5V 5.08,59.69; -5V@2 2.54,12.065; -12V@1 86.36,52.07; -12V@2 5.08,54.61; -12V@3 2.54,9.525; GND@1 2.54,22.225; GND@2 5.08,57.15; GND@3 2.54,46.99; GND@4 2.54,49.53; GND@5 86.36,54.61; GND@6 2.54,52.07; GND@7 86.36,49.53; GND@8 2.54,54.61; GND@9 2.54,57.15; GND@10 2.54,59.69; GND@11 86.36,44.45; GND@12 86.36,41.91; GND@13 2.54,19.685; GND@14 2.54,27.305; VIN@2 5.08,44.45; VIN@3 5.08,46.99; VIN@4 5.08,49.53 | drill 0.8 square: VIN@1 5.08,41.91
FCI87520 = drill 0.92: P1 -3.5,2.71; P2 -1,2.71; P3 1,2.71; P4 3.5,2.71 | drill 2.3: P$1 -6.57,0; P$2 6.57,0
FCI61729 = drill 1: 1 1.25,4.71; 2 -1.25,4.71; 3 -1.25,2.71; 4 1.25,2.71 | drill 2.3: P$1 -6.02,0; P$2 6.02,0

### Placement (x,y rotation side)
C1  113.07,19.27 0 bottom
C2  112.71,27.47 270 bottom
C3  10.15,37.52 180 bottom
C4  10.15,24.82 180 bottom
C5  86.44,51.24 90 bottom
C6  85.6,48.13 0 bottom
C8  26.67,34.29 270 bottom
C10  86.44,44.9 270 bottom
C15  75,44.9 270 bottom
C16  75,51.24 90 bottom
C18  6.97,25.46 90 bottom
C19  6.97,36.89 270 bottom
C20  84.45,34.92 270 bottom
C21  99.91,34.69 270 bottom
C22  77.47,34.92 270 bottom
C26  98.75,32.23 0 bottom
C27  91.91,38.69 180 bottom
D1  129.33,24.39 0 bottom
IC2  92.91,34.69 90 bottom
IC3  6.97,31.18 0 bottom
IC4  80.01,48.13 270 bottom
J1  138.08,-3 0 bottom
J2  234,36 90 bottom
J4  121.92,49.53 180 bottom
J5  121.92,34.92 180 bottom
JP1  99,0 90 bottom
JP2  68.11,52.52 90 top
JP3  68.11,43.62 90 top
JP4  92.71,43.56 90 top
JP5  92.71,52.45 90 top
JP7  46.99,27.11 0 top
JP8  46.99,5.99 180 top
L1  128.04,16.95 270 bottom
L2  118.83,28.63 0 bottom
LEDPOWER  104,52.73 90 top
LEDPOWER1  98,52.73 90 top
MAINTEENSY  46.99,42.45 270 bottom
POWERSWITCH  232.97,15.6 90 bottom
Q1  19.68,36.2 0 bottom
Q2  24.13,36.2 0 bottom
Q3  10.79,55.24 180 bottom
Q4  15.24,55.24 180 bottom
Q5  15.24,36.2 0 bottom
Q6  24.13,55.24 180 bottom
Q7  19.68,55.24 180 bottom
R1  121.87,28.63 180 bottom
R2  19.05,40.64 270 bottom
R3  39.37,46.45 270 bottom
R4  21.59,40.64 270 bottom
R5  112.71,24.3 90 bottom
R6  41.27,46.45 270 bottom
R7  99.16,37.94 180 bottom
R8  97.91,34.69 90 bottom
R9  114.48,24.3 270 bottom
R10  93.2,28.2 270 bottom
R11  90.86,28.18 270 bottom
R12  94.91,38.69 0 bottom
R13  88.86,28.18 270 bottom
R14  11.43,50.8 90 bottom
R15  44.45,52.7 0 bottom
R16  13.97,50.8 90 bottom
R17  45.09,54.61 0 bottom
R18  22.03,50.83 90 bottom
R19  86.86,28.18 270 bottom
R20  84.86,28.18 270 bottom
R21  41.78,55.63 0 bottom
R22  19.05,50.8 90 bottom
R23  59.69,38.73 0 bottom
R24  10.15,36.26 0 bottom
R25  15.24,30.48 180 bottom
R26  10.15,26.09 0 bottom
R27  15.24,33.02 180 bottom
R28  3.8,24.82 0 bottom
R35  3.12,39.47 270 bottom
R36  10.79,22.29 270 bottom
R37  3.8,26.09 0 bottom
R38  71.19,44.9 0 bottom
R39  13.97,40.64 270 bottom
R40  37.47,46.45 270 bottom
R41  73.73,44.9 90 bottom
R42  71.19,46.16 0 bottom
R43  89.03,49.91 180 bottom
R44  85.17,51.24 270 bottom
R45  89.03,51.18 180 bottom
R46  71.19,43.62 0 bottom
R47  89.03,52.45 180 bottom
R48  71.19,51.24 0 bottom
R49  73.73,51.24 270 bottom
R50  71.19,49.98 0 bottom
R51  71.19,52.52 0 bottom
R52  3.8,36.26 0 bottom
R53  10.15,39.43 0 bottom
R55  89.03,46.1 180 bottom
R56  85.17,44.9 90 bottom
R57  89.03,44.83 180 bottom
R58  89.03,43.56 180 bottom
SECONDTEENSY  46.99,16.05 270 bottom
U7  20.95,31.11 0 bottom
U$1  21.59,46.99 180 top
U$3  98.15,44.53 180 bottom
U$4  117,0 0 bottom
U$5  103.89,44.41 180 bottom
U$17  183.13,31.37 0 bottom
U$19  70.12,31.54 0 bottom
U$20  121.61,22.43 270 bottom
U$22  5.71,16.51 0 top
U$23  228,-4 0 bottom
U$25  228,-4 0 bottom  (outside the outline)
U$29  237.54,17.93 0 top
U$30  109.36,23.61 0 top
U$32  103.16,38.3 0 top
U$34  29.84,2.54 270 bottom
U$35  29.84,2.54 90 top
X1  75.17,17 180 bottom
X2  75.17,6 0 bottom
X3  19.16,18 180 bottom
X4  19.16,7 0 bottom

### Tracks (layer width: path | path; a pad name or v marks a point on that pad's centre or on a via)
3.3V  (via drill 0.3)
  Top 0.254: v88.39,47.37 v89.79,47.37
  Top 1: v107.82,27.56 v103.12,32.26 | v105.28,38.99 v105.28,41.02
  Bottom 0.254: U7.1 26.16,33.02 | 26.16,33.02 C8.2 | 26.16,33.02 26.42,33.02 29.08,35.69 29.08,36.83 31.11,38.86 34.67,38.86 35.56,37.97 MAINTEENSY.3.3V | C6.2 84.84,47.88 85.6,47.12 88.14,47.12 v88.39,47.37 | v89.79,47.37 91.44,47.37 JP4.3
  Bottom 0.5: U$20.8
  Bottom 0.508: R5.2 C2.2 116.71,26.71 U$20.8 117.28,26.35
  Bottom 1: 65.79,46.23 65.79,45.72 65.06,44.99 MAINTEENSY.3.3V1 | 65.79,46.23 68.05,46.23 JP3.3 | 65.79,46.23 65.79,51.18 65.15,51.82 65.15,54.1 66.17,55.12 68.05,55.12 JP2.3 JP5.3 93.47,54.99 95,53.59 95,48.01 93.16,46.16 JP4.3 92.84,45.97 94.11,45.97 95.38,44.7 95.38,43.56 97.92,41.02 v105.28,41.02 | v107.82,27.56 108.67,26.71 C2.2 | v103.12,32.26 105.28,34.42 v105.28,38.99 | IC4.4 C6.2
5V  (via drill 0.3)
  Top 1: v107.31,44.7 v114.94,44.7 | v121.54,44.7 125.6,44.7 v125.73,44.83 | v46.74,18.67 v56.9,18.67 | v28.45,29.08 v28.45,32.8
  Bottom 0.635: 62.23,19.81 65.28,19.81
  Bottom 1: J4.11 J4.12 v125.73,44.83 125.73,43.18 | 125.73,43.18 J5.11 J5.12 125.73,32.77 124.46,31.5 108.71,31.5 101.85,24.64 78.49,24.64 73.66,19.81 65.28,19.81 | U$23.5V@2 125.92,42.99 125.73,43.18 | J2.12 J2.11 226.1,39.81 U$23.5V@1 | U$23.5V@4 225.46,39.97 225.43,40.01 225.43,40.64 | LEDPOWER1.2 LEDPOWER.2 | LEDPOWER.2 104.62,55.27 104.65,55.24 | 104.65,55.24 104.03,55.24 LEDPOWER.2 | SECONDTEENSY.VIN 30.48,18.67 | 30.48,18.67 30.48,20.19 28.45,22.23 v28.45,29.08 | v28.45,32.8 MAINTEENSY.VIN | 104.65,55.24 105.66,55.24 107.31,53.59 v107.31,44.7 | v114.94,44.7 v121.54,44.7 | 30.48,18.67 v46.74,18.67 | v56.9,18.67 61.09,18.67 62.23,19.81
9TO18V  (via drill 0.3)
  Top 1: v223.52,32.38 223.52,31.75 v233.04,22.23
  Bottom 1: U$23.VIN@4 U$23.VIN@3 U$23.VIN@2 U$23.VIN@1 222.92,32.98 v223.52,32.38 | v233.04,22.23 233.04,18.21 | 233.04,18.21 POWERSWITCH.2 | 233.04,18.21 237.25,18.21 U$29.P$1
12V  (via drill 0.3)
  Top 1: v123.19,57.78 123.19,53.98 v123.83,53.34 | v106.81,37.85 v109.22,40.26 | v12.32,33.02 8.38,33.02 v6.99,31.62
  Bottom 0.508: IC2.8 97.45,32.78 C26.2
  Bottom 1: J5.10 J5.9 J4.10 J4.9 123.19,52.7 v123.83,53.34 141.45,53.34 U$23.12V@1 | J2.10 J2.9 231.58,37.27 222.88,28.57 222.88,12.06 224.16,10.79 225.27,10.79 U$23.12V@4 | C18.2 IC3.4 6.99,28.59 v6.99,31.62 | U$1.13 6.35,48.9 9.02,51.56 R14.2 R16.2 R22.2 22,51.56 R18.2 24.28,51.59 24.28,51.18 | 113.79,58.42 102.62,58.42 101.85,57.66 100.71,57.66 99.95,58.42 31.11,58.42 26.04,53.34 26.04,52.07 25.15,51.18 24.28,51.18 | 113.79,58.42 122.56,58.42 v123.19,57.78 | 24.28,51.18 24.28,41.43 22.73,39.88 R4.2 R2.2 R39.2 13.34,39.88 12.45,38.99 12.45,33.15 v12.32,33.02 | C26.2 97.99,31.17 98.93,30.23 103.12,30.23 106.81,33.91 v106.81,37.85 | v109.22,40.26 109.22,53.85 113.79,58.42
-12V  (via drill 0.3)
  Top 1: v137.79,51.44 v137.79,55.24 | v8.13,38.35 9.02,39.24 | v76.07,57.15 76.45,56.77 76.45,52.2 74.68,50.42 74.68,44.58 77.47,41.78 v78.23,41.78 | v92.96,35.43 101.35,35.43 v101.47,35.56 | v103.5,34.67 109.6,28.57 111,28.57 113.03,30.61 J5.2 | v9.02,42.67 9.02,39.24 | 9.02,39.24 10.79,37.47 20.19,37.47 23.11,40.39 v25.4,40.39
  Bottom 0.508: IC2.4 90.31,37.85 C27.1
  Bottom 1: J5.2 J5.1 J4.2 J4.1 113.03,53.34 114.94,55.24 v137.79,55.24 | U$23.-12V@1 138.62,48.07 137.79,48.9 v137.79,51.44 | J2.2 J2.1 227.33,21.71 227.33,6.99 225.87,5.53 U$23.-12V@3 | IC3.11 C19.2 7.55,36.13 8.13,36.7 v8.13,38.35 | v9.02,42.67 9.02,44.32 U$1.12 | v76.07,57.15 31.75,57.15 27.3,52.7 27.3,51.56 25.65,49.91 25.65,41.02 25.4,40.77 v25.4,40.39 | 90.31,37.98 IC2.4 91.81,36.59 v92.96,35.43 | 90.31,37.98 91.06,38.73 | v101.47,35.56 102.62,35.56 v103.5,34.67 | 90.31,37.98 89.65,37.98 86.61,41.02 81.79,41.02 81.03,41.78 v78.23,41.78
CLOCK1  (via drill 0.3)
  Top 0.254: v10.03,50.16 10.03,53.09 v10.16,53.21
  Bottom 0.254: U$1.9 R14.1 10.16,50.04 v10.03,50.16 | v10.16,53.21 10.16,53.51 Q3.C
CLOCK2  (via drill 0.3)
  Top 0.254: v15.24,50.29 v15.24,53.21
  Bottom 0.254: U$1.7 R16.1 14.99,50.04 v15.24,50.29 | v15.24,53.21 Q4.C
CLOCK3  (via drill 0.3)
  Top 0.254: v22.86,50.16 22.86,53.09 v23.11,53.34
  Bottom 0.254: U$1.1 22.03,47.43 R18.1 22.76,50.06 v22.86,50.16 | v23.11,53.34 23.32,53.34 Q6.C
CV1  (via drill 0.3)
  Top 0.254: v133.35,31.5 133.35,29.34 v133.22,29.21
  Bottom 0.254: J5.13 J5.14 128.27,32.26 128.91,31.62 133.22,31.62 v133.35,31.5 | R28.1 4.56,23.99 3.43,22.86 2.54,22.86 | 2.54,22.86 2.03,22.86 1.14,23.75 1.14,40.13 2.67,41.66 9.91,41.66 11.43,43.18 U$1.10 | v133.22,29.21 133.22,22.99 136.91,19.3 136.91,15.37 134.37,12.83 130.56,12.83 125.09,7.37 110.24,7.37 103.63,13.97 85.22,13.97 74.42,3.17 13.34,3.17 2.41,14.1 2.41,22.73 2.54,22.86
CV2  (via drill 0.3)
  Top 0.254: v128.27,56.52 J4.13 | v12.7,42.55 v14.99,42.55 | v129.03,46.1 129.16,46.1 131.19,44.07 v131.19,41.66 | v135.38,31.5 135.38,29.59 v135.51,29.46 | v1.65,41.91 1.65,40.64 v2.16,40.13
  Bottom 0.254: J4.13 J4.14 128.27,46.86 v129.03,46.1 | J2.14 J2.13 231.97,42.35 230.5,43.81 230.5,50.16 229.87,50.8 229.87,55.88 227.33,58.42 133.35,58.42 131.44,56.52 v128.27,56.52 | v12.7,42.55 10.39,40.23 R35.1 3.02,40.13 v2.16,40.13 | v14.99,42.55 14.99,42.93 U$1.6 | v131.19,41.66 131.19,39.37 135.38,35.18 v135.38,31.5 | v135.51,29.46 135.51,21.84 137.54,19.81 137.54,14.99 134.75,12.19 130.81,12.19 125.35,6.73 109.98,6.73 103.63,13.08 85.22,13.08 74.8,2.67 12.7,2.67 1.52,13.84 1.52,22.23 0.64,23.11 0.64,40.89 v1.65,41.91
DACCS  (via drill 0.3)
  Top 0.254: v58.42,31.62 MAINTEENSY.15/A1
  Bottom 0.254: U7.2 58.04,31.75 58.29,31.75 v58.42,31.62
DACSCK  (via drill 0.3)
  Top 0.254: v63.5,30.99 MAINTEENSY.13
  Bottom 0.254: U7.3 25.15,30.48 25.65,30.99 v63.5,30.99
DACSDI  (via drill 0.3)
  Top 0.254: v29.97,30.23 v29.97,32.38 | v46.99,39.12 v46.99,43.18 | v56.26,51.82 v59.82,51.82
  Bottom 0.254: U7.4 25.4,29.21 26.42,30.23 v29.97,30.23 | v29.97,32.38 45.72,32.38 46.99,33.66 v46.99,39.12 | v46.99,43.18 46.99,45.21 49.53,47.75 49.53,51.31 50.04,51.82 v56.26,51.82 | v59.82,51.82 59.82,51.21 MAINTEENSY.11
G1  (via drill 0.3)
  Top 0.254: v15.24,38.86 v15.24,41.27 | v22.48,36.96 v27.94,36.96 | v57.91,37.08 61.47,37.08 62.48,36.07 v65.66,36.07 | v79.12,26.29 v79.12,23.5 | v130.68,29.59 130.68,33.53 J5.16
  Bottom 0.254: U$1.8 R39.1 14.1,41.27 v15.24,41.27 | v15.24,38.86 Q5.C 17.06,37.3 18.16,36.2 20.57,36.2 21.34,36.96 v22.48,36.96 | J5.16 J5.15 | v27.94,36.96 30.73,39.75 55.24,39.75 v57.91,37.08 | v65.66,36.07 66.93,37.34 69.47,37.34 72.26,34.54 72.26,33.15 v79.12,26.29 | v79.12,23.5 102.23,23.5 108.33,29.59 v130.68,29.59
G2  (via drill 0.3)
  Top 0.254: v130.81,57.15 J4.15 | v17.78,38.86 v17.78,41.27 | v23.11,38.1 27.18,38.1 29.59,40.51 v31.5,40.51 | v57.66,38.61 64.9,38.61 v65.66,37.85 | v109.73,37.21 109.73,38.86 110.62,39.75 v114.55,39.75 | v122.17,42.67 127,42.67 v128.52,44.2
  Bottom 0.254: J2.16 J2.15 232.73,49.84 230.5,52.07 230.5,56.52 227.97,59.05 132.72,59.05 v130.81,57.15 | J4.15 J4.16 130.81,46.48 v128.52,44.2 | U$1.4 R2.1 18.92,41.27 v17.78,41.27 | v17.78,38.86 18.41,38.1 19.05,38.1 19.68,37.47 Q1.C 20.4,37.3 21.21,38.1 v23.11,38.1 | v31.5,40.51 55.75,40.51 v57.66,38.61 | v65.66,37.85 69.98,37.85 73.53,34.29 73.53,33.02 80.39,26.16 100.84,26.16 110.24,35.56 110.24,36.7 v109.73,37.21 | v114.55,39.75 119.25,39.75 v122.17,42.67
G3  (via drill 0.3)
  Top 0.254: v19.43,38.86 20.32,39.62 v20.32,41.27
  Bottom 0.254: U$1.2 R4.1 21.46,41.27 v20.32,41.27 | Q2.C 24.13,38.35 23.62,38.86 v19.43,38.86
GND  (via drill 0.3, 4 pad 6)
  Top 0.254: v12.57,56.39 12.83,56.39 | v16.89,56.39 17.14,56.39 | v21.46,56.39 21.72,56.39 | v26.04,56.39 26.29,56.39 | v6.99,38.48 6.99,38.61 | v5.71,35.31 5.71,35.43 | v8.26,35.31 8.26,35.56 | v14.22,36.2 13.97,36.2 | v17.91,35.05 17.78,35.05 17.65,34.92 | v22.35,35.05 22.23,35.05 | v5.71,30.1 5.71,30.23 | v8.26,30.1 8.26,30.23 | v6.99,23.88 6.99,23.75 | v20.07,29.21 20.19,29.21 | v20.07,31.75 20.32,31.75 | v87.38,48.13 87.88,48.01 88.01,48.13 | v81.15,49.4 81.66,49.4 | v75.95,46.86 75.69,46.86 | v78.99,49.4 79.25,49.4 | v84.2,46.86 84.45,46.86 | v113.92,20.19 113.92,20.57 | v27.69,35.31 27.69,35.43 | v79.12,48.13 79.38,48.13
  Top 0.508: v113.6,28.11 113.72,28.23 | v115.12,25.06 115.5,25.06 | v93.97,27.43 93.96,27.05 | v93.41,38.69 93.41,38.44 | v100.31,32.23 99.45,32.23
  Bottom 0.254: Q3.E 12.53,56.34 v12.57,56.39 | Q4.E 16.85,56.34 v16.89,56.39 | Q7.E 21.42,56.34 v21.46,56.39 | Q6.E 25.99,56.34 v26.04,56.39 | C19.1 6.97,38.47 v6.99,38.48 | IC3.10 5.71,35.3 v5.71,35.31 | IC3.12 8.24,35.3 v8.26,35.31 | Q5.E 14.27,35.09 v14.22,36.2 | Q1.E 17.95,35.09 v17.91,35.05 | Q2.E 22.39,35.09 v22.35,35.05 | IC3.5 5.71,30.09 v5.71,30.1 | IC3.3 8.24,30.09 v8.26,30.1 | C18.1 6.97,23.89 v6.99,23.88 | U7.5 v20.07,29.21 | U7.7 v20.07,31.75 | C6.1 v87.38,48.13 | IC4.3 v81.15,49.4 | IC4.10 v75.95,46.86 | IC4.12 v78.99,49.4 | IC4.5 v84.2,46.86 | C1.1 113.83,20.11 v113.92,20.19 | C8.1 27.43,35.05 v27.69,35.31 | IC4.11 v79.12,48.13
  Bottom 0.508: U$20.5 115.82,18.62 v115.61,18.42 | C2.1 113.47,28.23 v113.6,28.11 | R9.1 v115.12,25.06 | R10.2 v93.97,27.43 | R12.2 v93.41,38.69 C27.2 | C26.1 99.72,32.22 v100.31,32.23
  other vias: 5,5 5,55 86,4 235,5 235,55 132.91,16.73
  pour Top: -5,-21 -5,66.01 arc-90 -3.01,68.01 257,69 257,-24
KNOB_L1
  Bottom 0.254: R46.2 JP3.2
KNOB_L2
  Bottom 0.254: R47.2 JP5.2
KNOB_X1
  Bottom 0.254: R51.2 JP2.2
KNOB_X2
  Bottom 0.254: R58.2 JP4.2
L1  (via drill 0.3)
  Top 0.254: v22.99,45.34 28.57,45.34 v29.21,45.97 | v35.81,45.47 37.08,45.47 v39.5,43.05 | v56.26,42.93 v57.66,44.32
  Bottom 0.254: U$1.5 16.51,46.86 17.78,45.59 22.73,45.59 v22.99,45.34 | v29.21,45.97 35.31,45.97 v35.81,45.47 | v39.5,43.05 40.13,42.42 55.75,42.42 v56.26,42.93 | R38.2 70.37,44.83 66.42,44.83 65.28,43.69 61.09,43.69 60.33,42.93 59.05,42.93 v57.66,44.32
L1_ADC  (via drill 0.3)
  Top 0.254: v57.15,28.96 57.15,31.62 v55.88,32.89 | v71.75,38.1 71.63,38.1 v69.34,35.81
  Bottom 0.254: IC4.8 74.93,44.32 C15.2 R41.1 73.73,40.08 v71.75,38.1 | JP8.4 SECONDTEENSY.16/A2 55.88,21.08 57.15,22.35 v57.15,28.96 | MAINTEENSY.16/A2 v55.88,32.89 56.01,33.02 67.18,33.02 69.34,35.18 v69.34,35.81
L2  (via drill 0.3)
  Top 0.254: v8.38,49.53 8.26,49.53 v6.73,51.05 | v24.77,52.7 24.77,52.32 25.65,51.44 25.65,50.55 v26.8,49.4 | v44.45,51.56 v48.64,55.75 | v89.79,56.39 89.79,49.02 v89.92,48.9 | v78.11,56.01 v78.11,53.98 | v66.17,53.72 v64.01,53.72
  Bottom 0.254: U$1.11 8.89,49.02 v8.38,49.53 | v6.73,51.05 6.99,51.18 8.26,52.45 24.51,52.45 v24.77,52.7 | v26.8,49.4 28.32,50.8 28.32,52.2 29.46,53.34 33.27,53.34 34.8,51.82 44.2,51.82 v44.45,51.56 | v48.64,55.75 48.64,55.5 50.55,53.59 63.88,53.59 v64.01,53.72 | v89.79,56.39 89.53,56.64 78.74,56.64 v78.11,56.01 | v89.92,48.9 89.92,49.78 R43.2 | v78.11,53.98 69.85,53.98 69.72,53.85 66.29,53.85 v66.17,53.72
L2_ADC  (via drill 0.3)
  Top 0.254: v54.61,28.96 54.61,32.26 v53.34,33.53 | v55.37,37.97 58.67,41.27 v60.71,41.27 | v72.9,41.91 74.42,41.91 v74.55,41.78 | v77.98,43.31 77.98,50.29 v79.38,51.69
  Bottom 0.254: C5.2 R44.1 85.09,51.94 IC4.1 79.63,51.94 v79.38,51.69 | JP8.5 SECONDTEENSY.17/A3 53.34,21.08 54.61,22.35 v54.61,28.96 | v53.34,33.53 MAINTEENSY.17/A3 53.37,34.83 54.86,36.32 54.86,37.47 v55.37,37.97 | v60.71,41.27 62.1,41.27 62.36,41.02 65.02,41.02 66.55,39.5 70.48,39.5 v72.9,41.91 | v74.55,41.78 76.45,41.78 v77.98,43.31
MAIN_TO_SECOND  (via drill 0.3)
  Top 0.254: JP7.9 50.8,30.48 49.53,31.75 v49.53,36.45 | v49.53,38.99 49.53,42.93 v49.66,43.05
  Bottom 0.254: JP7.9 SECONDTEENSY.7 | v49.53,36.45 v49.53,38.99 | v49.66,43.05 51.82,43.05 53.34,44.58 MAINTEENSY.8
MIDI  (via drill 0.3)
  Top 0.254: v100.58,27.18 101.35,27.18 v104.14,24.38
  Bottom 0.254: U$20.6 117.12,21.12 114.61,21.12 112.71,23.02 R5.1 109.43,23.53 U$30.P$1 108.58,24.38 v104.14,24.38 | MAINTEENSY.9 55.88,44.96 62.23,38.61 70.23,38.61 73.91,34.92 78.23,34.92 83.06,30.1 94.74,30.1 97.66,27.18 v100.58,27.18
N$2
  Bottom 0.508: U$20.7 114.66,23.7 R9.2
N$3
  Bottom 0.254: C22.- C20.-
N$6
  Bottom 0.254: U$4.5 126.87,15.02 L1.2
N$7
  Bottom 0.254: U$4.4 111.92,12.67 115.32,9.27 118.49,9.27 119.63,10.41 119.63,26.43 L2.2
N$10  (via drill 0.3)
  Top 0.254: v62.61,52.7 v62.61,54.61 | v93.6,57.15 93.85,57.02 95.12,55.75 95.12,47.24 v95.89,46.48
  Bottom 0.254: MAINTEENSY.VBAT 63.47,47.53 62.1,48.9 62.1,52.2 v62.61,52.7 | 62.61,54.74 v62.61,54.61 63.5,55.5 64.39,56.26 76.45,56.26 77.34,57.28 93.47,57.28 v93.6,57.15 | v95.89,46.48 96.2,46.48 U$3.P$1
N$12
  Bottom 0.254: SECONDTEENSY.VBAT 72.47,21.13 76.83,25.53 101.22,25.53 108.46,32.77 110.62,32.77 111.12,33.27 111.12,37.16 U$5.P$1
N$13
  Bottom 0.254: R7.1 98.39,35.48 98.42,35.45
  Bottom 0.508: IC2.6 97.78,35.32 R8.2 98.42,35.45 C21.1
N$14
  Bottom 0.254: C20.+ 84.45,31.75 84.84,31.24 92.33,31.24 92.71,31.62 92.71,33.02 93.74,34.05 IC2.7
  Bottom 0.508: C21.2 R8.1 97.78,34.05 IC2.7
N$15
  Bottom 0.254: C22.+ 77.47,31.75 80.01,29.21 84.59,29.21 R20.1
  Bottom 0.508: R20.1 R19.1 R13.1 R11.1 92.86,28.94 R10.1
N$16
  Bottom 0.508: IC2.5 95.5,38.52 R12.1
N$17
  Bottom 0.254: Q1.B 20.64,35.24 21.59,36.2 25.15,36.2 32.89,43.94 37.62,43.94 R3.2
N$18
  Bottom 0.254: Q2.B 25.08,35.11 32.89,42.93 38.51,42.93 R6.2
N$19  (via drill 0.3)
  Top 0.254: v29.59,58.29 29.72,58.29 31.5,58.29 33.91,55.88 v33.91,53.98
  Bottom 0.254: Q3.B 9.85,57.34 11.18,58.67 29.21,58.67 v29.59,58.29 | v33.91,53.98 35.18,52.7 R15.2
N$20  (via drill 0.3)
  Top 0.254: v28.45,57.28 28.83,56.9 31.37,56.9 32.26,56.01 v32.26,54.61
  Bottom 0.254: Q4.B 14.29,56.71 15.75,58.17 27.56,58.17 v28.45,57.28 | v32.26,54.61 R17.2
N$21  (via drill 0.3)
  Top 0.254: v27.3,56.26 28.96,54.61 v30.73,54.61
  Bottom 0.254: Q6.B 23.18,56.58 24.13,57.53 26.04,57.53 v27.3,56.26 | v30.73,54.61 31.75,55.63 R21.2
N$22  (via drill 0.3)
  Top 0.254: v25.53,54.61 27.18,52.96 27.18,51.18 v28.45,49.91 | v30.86,43.18 v32.64,41.4
  Bottom 0.254: Q7.B 18.73,55.81 19.3,55.24 24.89,55.24 v25.53,54.61 | v28.45,49.91 28.57,49.66 28.57,45.47 v30.86,43.18 | v32.64,41.4 32.64,41.53 32.89,41.78 55.88,41.78 R23.2
N$23
  Bottom 0.254: IC3.1 10.79,26.22 R26.1 C4.2 10.91,23.17 R36.1
N$24
  Bottom 0.254: IC3.14 10.79,36.13 R24.1 C3.2 R53.1
N$25
  Bottom 0.254: C3.1 R24.2 9.52,36.13 IC3.13 9.52,32.4 10.16,31.75 13.21,31.75 R27.1
N$26
  Bottom 0.254: R25.1 10.16,30.48 9.53,29.84 9.53,28.59 IC3.2 9.52,26.22 R26.2 C4.1
N$27
  Bottom 0.254: IC4.6 84.96,45.59 R56.2 C10.1 87.7,45.66 R55.1 R57.1 R58.1
N$30
  Bottom 0.254: JP7.2 SECONDTEENSY.0
N$31
  Bottom 0.254: IC3.6 4.43,26.22 R37.1 5.02,26.09 5.71,25.4 5.71,22.86 6.99,21.59 10.72,21.59 R36.2
N$35
  Bottom 0.254: IC3.7 3.17,26.22 R37.2 R28.2
N$36
  Bottom 0.254: IC3.9 4.43,36.13 R52.1 4.56,38.22 5.71,39.37 9.33,39.37 R53.2
N$37
  Bottom 0.254: R27.2 U7.8
N$38
  Bottom 0.254: R25.2 U7.6
N$39
  Bottom 0.254: JP7.3 SECONDTEENSY.1
N$40
  Bottom 0.254: U$4.2 117,13.68 112.52,18.16 112.52,19.05 C1.2
N$41
  Bottom 0.508: L2.1 R1.1
N$42
  Bottom 0.254: U$20.3 127.64,21.16 | 127.64,21.16 128.48,21.16 130.18,22.86 130.18,23.24 D1.ANODE | L1.1 128.04,20.76 127.64,21.16
N$43
  Bottom 0.254: U$20.2 126.58,23.7 128.27,25.4 129.27,25.4 D1.CATHODE
  Bottom 0.508: U$20.2 122.98,23.7 122.56,24.13 122.56,28.32 R1.2
N$44
  Bottom 0.254: R46.1 R38.1 R42.1 72.47,45.66 R41.2 C15.1 75.18,45.59 IC4.9
N$45
  Bottom 0.254: JP7.4 SECONDTEENSY.2
N$46
  Bottom 0.254: IC4.2 85.09,50.67 arc-238 R44.2 C5.1 87.7,50.48 R43.1 R45.1 R47.1
N$47
  Bottom 0.254: JP7.5 SECONDTEENSY.3
N$48
  Bottom 0.254: IC4.13 75.06,50.67 C16.1 R49.2 72.47,50.48 R50.1 R48.1 R51.1
N$49
  Bottom 0.254: JP7.6 SECONDTEENSY.4
N$50
  Bottom 0.254: JP7.7 SECONDTEENSY.5
N$51
  Bottom 0.254: JP7.8 SECONDTEENSY.6
N$52
  Bottom 0.254: JP7.11 SECONDTEENSY.9
N$53
  Bottom 0.254: JP7.12 SECONDTEENSY.10
N$54
  Bottom 0.254: JP7.13 SECONDTEENSY.11
N$55
  Bottom 0.254: JP7.14 SECONDTEENSY.12
N$56
  Bottom 0.254: SECONDTEENSY.13 JP8.1
N$57
  Bottom 0.254: SECONDTEENSY.14/A0 JP8.2
N$58
  Bottom 0.254: SECONDTEENSY.15/A1 JP8.3
N$59
  Bottom 0.254: SECONDTEENSY.20/A6 JP8.8
N$60  (via drill 0.3)
  Top 0.254: v25.4,33.78 27.43,33.78 34.42,40.77 v34.42,44.7
  Bottom 0.254: Q5.B 16.19,34.99 17.4,33.78 v25.4,33.78 | v34.42,44.7 36.48,44.7 R40.2
N$61
  Bottom 0.254: SECONDTEENSY.21/A7 JP8.9
N$62
  Bottom 0.254: SECONDTEENSY.22/A8 JP8.10
N$63
  Bottom 0.254: SECONDTEENSY.23/A9 JP8.11
N$94
  Bottom 0.254: IC3.8 3.17,36.13 R52.2 3.04,38.63 R35.2
OUT_CLOCK1
  Bottom 0.254: MAINTEENSY.5 45.72,52.2 R15.1
OUT_CLOCK2
  Bottom 0.254: MAINTEENSY.6 48.26,52.2 R17.1
OUT_CLOCK3
  Bottom 0.254: MAINTEENSY.10 58.42,51.44 57.15,52.7 50.29,52.7 47.37,55.63 R21.1
OUT_G1
  Bottom 0.254: MAINTEENSY.2 38.1,47.85 R40.1
OUT_G2
  Bottom 0.254: MAINTEENSY.3 40.64,48.48 R3.1
OUT_G3
  Bottom 0.254: MAINTEENSY.4 43.18,49.12 R6.1
OUT_RESET
  Bottom 0.254: MAINTEENSY.14/A0 60.96,38.23 R23.1
OUTPUT  (via drill 0.3)
  Top 0.254: v101.35,58.8 v101.35,53.98 | v100.71,42.42 v100.71,37.94
  Bottom 0.254: U$32.P$1 102.79,37.94 v100.71,37.94 R7.2 | U$1.14 6.35,44.58 5.08,45.85 5.08,48.51 1.02,52.58 1.02,56.77 3.56,59.31 100.84,59.31 v101.35,58.8 | v100.71,42.42 100.71,53.34 v101.35,53.98
OUTTIPLEFT  (via drill 0.3)
  Top 0.254: v91.82,27.3 v91.82,20.32
  Bottom 0.254: R11.2 91.71,27.41 v91.82,27.3 | v91.82,20.32 91.82,17.03 JP1.P$6
  Bottom 0.508: 90.87,27.43 R11.2 R13.2 R19.2 R20.2
REF_-5V  (via drill 0.3)
  Top 0.254: v108.2,34.67 110.11,32.77 v110.11,30.48
  Bottom 0.254: U$23.-5V 169.35,55.69 144.15,30.48 v110.11,30.48 | 89.03,44.7 89.03,42.16 91.57,39.62 95.25,39.62 95.63,40.01 106.05,40.01 107.95,38.1 107.95,34.8 v108.2,34.67 | 89.03,44.7 89.15,44.83 R57.2 | 89.03,44.7 89.03,48.77 | 89.03,48.77 89.03,51.05 89.15,51.18 R45.2 | R42.2 70.43,48.67 | 70.43,48.67 R50.2 | 70.43,48.67 72.16,48.67 73.03,49.53 75.31,49.53 75.82,50.04 84.2,50.04 85.22,49.02 88.77,49.02 89.03,48.77
RESET  (via drill 0.3)
  Top 0.254: v20.07,50.16 v20.07,53.21
  Bottom 0.254: U$1.3 R22.1 19.94,50.04 v20.07,50.16 | v20.07,53.21 20.07,53.76 Q7.C
SECOND_TO_MAIN  (via drill 0.3)
  Top 0.254: JP7.10 53.34,31.88 52.07,33.15 v52.07,37.21 | v52.07,44.45 v52.07,39.12
  Bottom 0.254: JP7.10 SECONDTEENSY.8 | MAINTEENSY.7 50.8,45.72 v52.07,44.45 | v52.07,39.12 v52.07,37.21
USB_N
  Bottom 0.254: X1.P2 74.25,14.29 76.4,12.14 76.4,10.73 X2.2
USB_N2
  Bottom 0.254: X3.P2 18.16,13.96 X4.2
USB_P
  Bottom 0.254: X1.P3 76.17,13.08 76.76,12.5 77.54,12.5 78.49,11.56 78.49,10.77 X2.3
USB_P2
  Bottom 0.254: X3.P3 20.16,14.64 21.97,12.83 21.97,11.28 X4.3
VIN
  Bottom 1: POWERSWITCH.1 232.97,9.45 225.43,1.91 146.05,1.91 137.16,10.79 J1.PWR
VUSB  (via drill 0.3)
  Top 0.254: v71.63,21.97 v71.63,18.41 | v32.13,33.02 v32.13,30.1
  Bottom 0.254: MAINTEENSY.VUSB 33.02,37.34 31.75,36.07 31.75,33.4 v32.13,33.02 | v71.63,21.97 63.75,29.84 32.38,29.84 v32.13,30.1 | v71.63,18.41 71.63,14.34 X1.P1
  Bottom 1: X1.P1 71.67,12.96 X2.1
VUSB2  (via drill 0.3)
  Top 1: SECONDTEENSY.VUSB 28.65,10.97 v28.57,11.05
  Bottom 1: X3.P1 15.65,13.96 X4.1 17.88,11.68 16.51,11.68 15.88,11.05 15.88,8.76 16.76,7.87 21.59,7.87 24.77,11.05 v28.57,11.05
X1_ADC  (via drill 0.3)
  Top 0.254: v52.07,28.96 52.07,31.75 v50.8,33.02 | v54.74,39.12 v59.44,43.81 | v73.79,52.83 73.79,52.2 69.85,48.26 v69.6,48.26 | v66.93,47.75 66.04,47.75 v64.77,46.48
  Bottom 0.254: IC4.14 75.18,51.94 C16.2 R49.1 73.73,52.78 v73.79,52.83 | JP8.6 SECONDTEENSY.18/A4 50.8,21.21 52.07,22.48 v52.07,28.96 | v50.8,33.02 MAINTEENSY.18/A4 50.96,34.83 53.47,37.34 53.47,37.85 v54.74,39.12 | v69.6,48.26 67.44,48.26 v66.93,47.75 | v64.77,46.48 64.64,46.35 61.98,46.35 v59.44,43.81
X2_ADC  (via drill 0.3)
  Top 0.254: v49.53,28.96 48.26,30.23 v48.26,32.89 | v81.92,43.31 v79.38,40.77 | v72.9,37.08 v70.61,34.8
  Bottom 0.254: C10.2 R56.1 84.96,44.32 IC4.7 82.17,44.32 81.92,44.07 v81.92,43.31 | JP8.7 SECONDTEENSY.19/A5 48.26,21.34 49.53,22.61 v49.53,28.96 | JP8.7 48.26,5.71 48.51,5.46 48.51,5.73 JP8.7 | MAINTEENSY.19/A5 v48.26,32.89 48.9,32.26 67.82,32.26 70.1,34.8 v70.61,34.8 | v79.38,40.77 76.58,40.77 v72.9,37.08